# Altium project iMX6_Pixhawk.PrjPcb (part 3 of 6)

## Sheet [09] - USB.SchDoc
size A2; DocumentNumber: 9; SheetNumber: 9; SheetTotal: 18
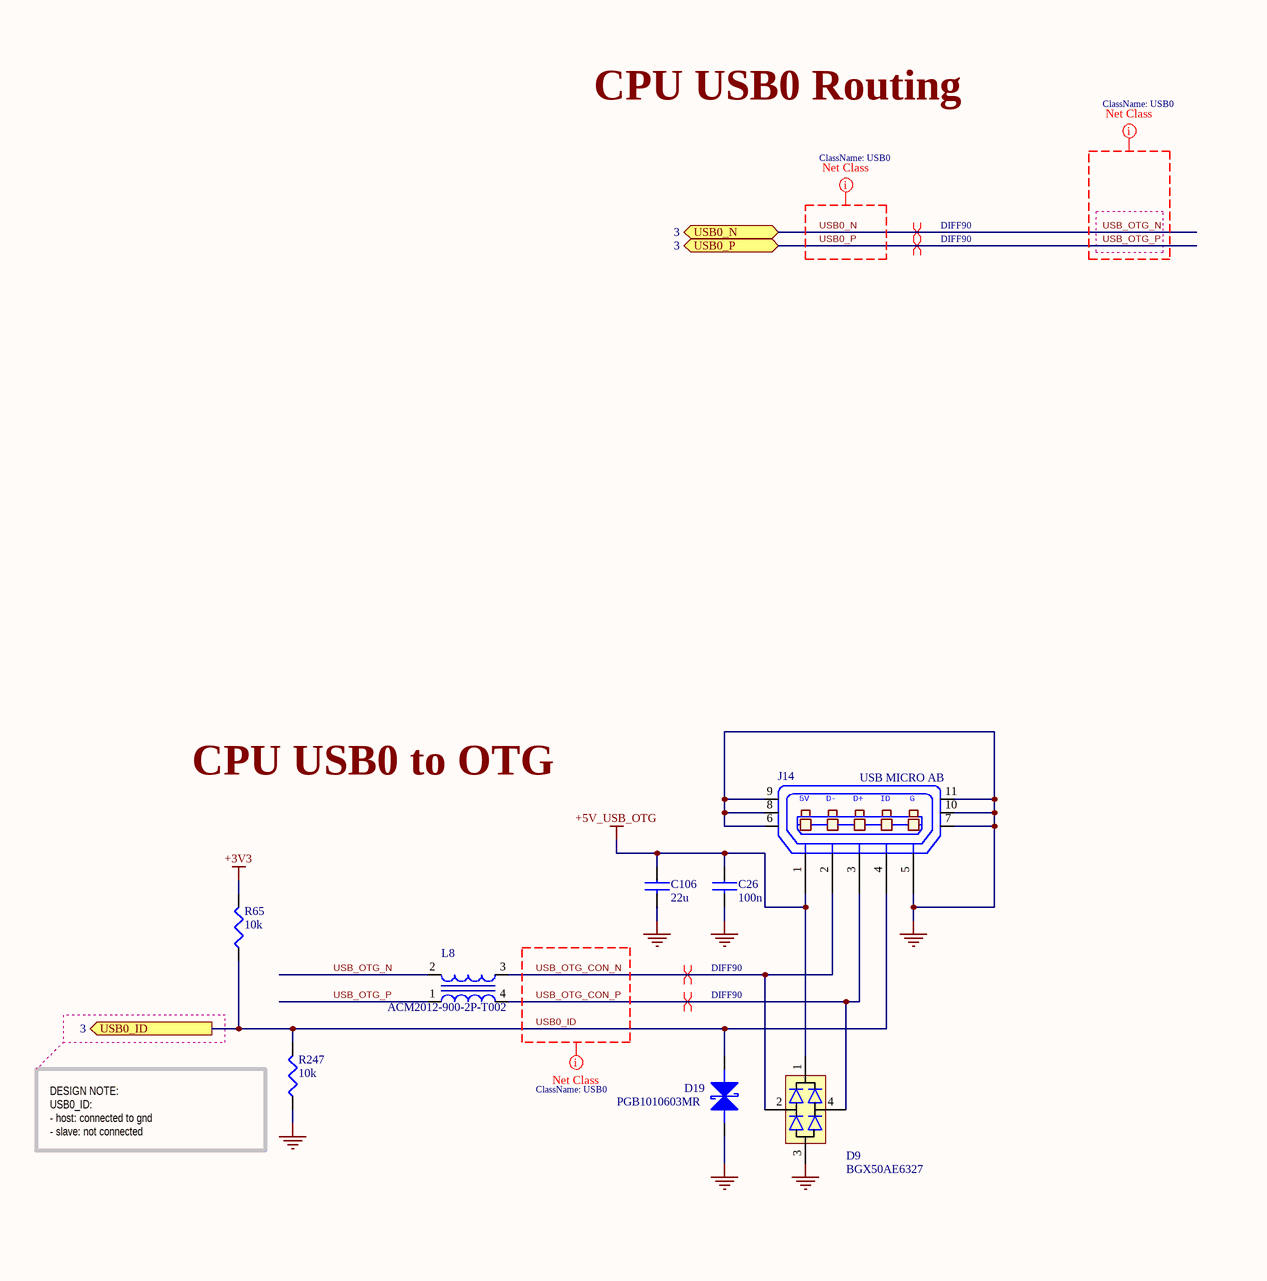
[diagram p10: [09] - USB.SchDoc, left]
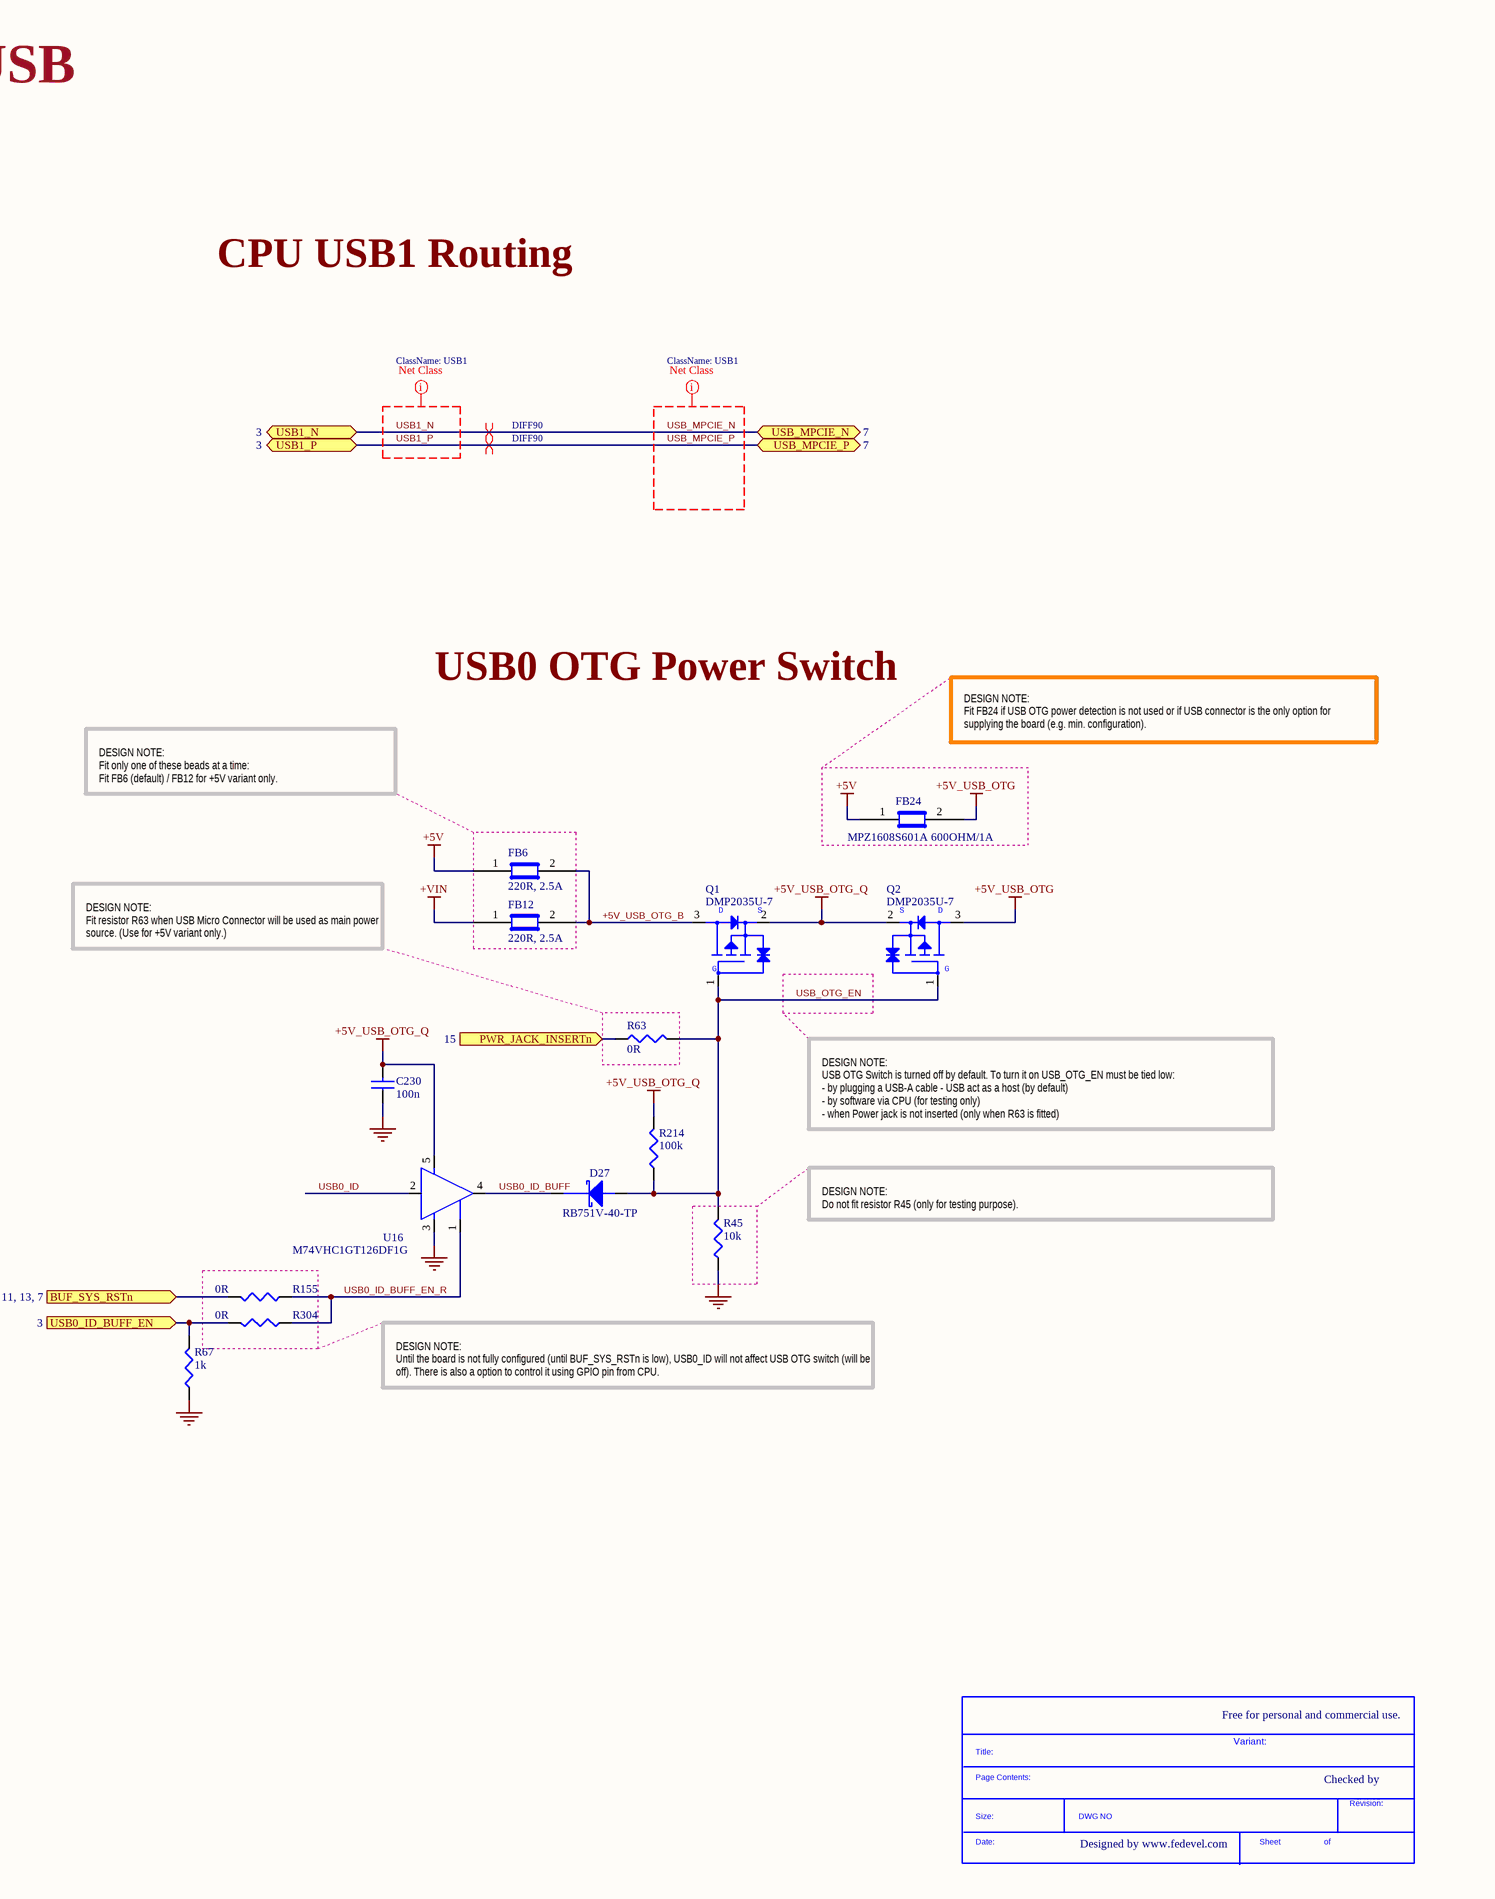
[diagram p11: [09] - USB.SchDoc, right]

### Parts
(Parts that share a designator on the sheet are numbered #1, #2 ... from top to bottom, then left to right.)
*#7  SDTitleBlock  (value not drawn)  (graphical)
C26  100n  [C0402]
C106  22u  [C0805]
C230  100n  [C0402]
D9  BGX50AE6327  [SOT143]
D19  PGB1010603MR  [C0603]
D27  RB751V-40-TP  [SOD323]
FB6  220R, 2.5A  [C0603]
FB12  220R, 2.5A  [C0603]
FB24  MPZ1608S601A 600OHM/1A  [C0603]
J14  USB MICRO AB  [USB_Micro_AB]
L8  ACM2012-900-2P-T002  [ACM2012]
Q1  DMP2035U-7  [SOT-23-3-123]
Q2  DMP2035U-7  [SOT-23-3-123]
R45  10k  [R0402]
R63  0R  [R0402]
R65  10k  [R0402]
R67  1k  [R0402]
R155  0R  [R0402]
R214  100k  [R0402]
R247  10k  [R0402]
R304  0R  [R0402]
U16  M74VHC1GT126DF1G  [SC70_5]

### Ports
BUF_SYS_RSTn (see 11, 13, 7), PWR_JACK_INSERTn (in, see 15), USB0_ID (out, see 3), USB0_ID_BUFF_EN (in, see 3), USB0_N (bidir, see 3), USB0_P (bidir, see 3), USB1_N (bidir, see 3), USB1_P (bidir, see 3), USB_MPCIE_N (bidir, see 7), USB_MPCIE_P (bidir, see 7)

### Nets
+3V3: R65.2
+5V: FB6.1 FB24.1
+5V_USB_OTG: C26.1 C106.1 D9.1 FB24.2 J14.1(P1) Q2.3
+5V_USB_OTG_Q: C230.2 Q1.2 Q2.2 R214.2 U16.5(VCC)
+VIN: FB12.1
GND: C26.2 C106.2 C230.1 D9.3 D19.2 J14.5(P5) J14.6 J14.7 J14.8 J14.9 J14.10 J14.11 R45.1 R67.1 R247.1 U16.3(GND)
+5V_USB_OTG_B: FB6.2 FB12.2 Q1.3
USB0_ID: D19.1 J14.4(P4) R65.1 R247.2 U16.2(I) ; port USB0_ID
USB0_ID_BUFF: D27.1(cathode) U16.4(O)
USB0_ID_BUFF_EN_R: R155.1 R304.1 U16.1(OE#)
USB0_N: L8.2 ; port USB0_N  [also labelled USB_OTG_N]
USB0_P: L8.1 ; port USB0_P  [also labelled USB_OTG_P]
USB1_N: port USB1_N, port USB_MPCIE_N  [also labelled USB_MPCIE_N]
USB1_P: port USB1_P, port USB_MPCIE_P  [also labelled USB_MPCIE_P]
USB_OTG_CON_N: D9.2 J14.2(P2) L8.3
USB_OTG_CON_P: D9.4 J14.3(P3) L8.4
USB_OTG_EN: D27.2(ANODE) Q1.1 Q2.1 R45.2 R63.2 R214.1
NetJ1_38: R67.2 R304.2 ; port USB0_ID_BUFF_EN
NetJ13_22: R155.2 ; port BUF_SYS_RSTn
NetR63_1: R63.1 ; port PWR_JACK_INSERTn

### Layout directives
differential pair; net class DIFF90: USB0_N, USB0_P, USB1_N, USB1_P, USB_OTG_CON_N, USB_OTG_CON_P
net class USB0: USB0_ID, USB0_N, USB0_P, USB_OTG_CON_N, USB_OTG_CON_P, USB_OTG_N, USB_OTG_P
net class USB1: USB1_N, USB1_P, USB_MPCIE_N, USB_MPCIE_P

### Notes on the sheet
- USB
- CPU USB0 Routing
- CPU USB1 Routing
- USB0 OTG Power Switch
- DESIGN NOTE:
  Fit FB24 if USB OTG power detection is not used or if USB connector is the only option for supplying the board (e.g. min. configuration).
- DESIGN NOTE:
  Fit only one of these beads at a time:
  Fit FB6 (default) / FB12 for +5V variant only.
- CPU USB0 to OTG
- DESIGN NOTE:
  Fit resistor R63 when USB Micro Connector will be used as main power source. (Use for +5V variant only.)
- DESIGN NOTE:
  USB OTG Switch is turned off by default. To turn it on USB_OTG_EN must be tied low:
  - by plugging a USB-A cable - USB act as a host (by default)
  - by software via CPU (for testing only)
  - when Power jack is not inserted (only when R63 is fitted)
- DESIGN NOTE:
  Do not fit resistor R45 (only for testing purpose).
- (near R247) DESIGN NOTE:
  USB0_ID:
  - host: connected to gnd
  - slave: not connected
- DESIGN NOTE:
  Until the board is not fully configured (until BUF_SYS_RSTn is low), USB0_ID will not affect USB OTG switch (will be off). There is also a option to control it using GPIO pin from CPU.
- Free for personal and commercial use.
- Variant:
- Checked by
- Designed by www.fedevel.com
- (in symbol 0475890001) 5V; D-; D+; ID; G
- (in symbol DMP2035U-7) D; S; G
- (in symbol SDTitleBlock) Title:; Page Contents:; Revision:; Size:; DWG NO; Date:; Sheet; of

### Library data of the parts
C26 C230 = C1005X5R1H104K: CAP CER .10UF 50V X5R 10% 0402; Manufacturer: TDK Corporation; Capacitance: 0.1µF; Value: 100nF; .Checked PCB: used; Category: Capacitors; Supplier Part Number: 445-5942-1-ND; Manufacturer Part Number: C1005X5R1H104K; Operating Temperature: -55°C ~ 85°C; Package / Case: 0402 (1005 Metric); Price 1k [$]: 0.02340; .Checked SCH: used; Voltage - Rated: 50V; Supplier: Digikey; Supplier 1: Digi-Key; Supplier Part Number 1: 445-5942-1-ND; RoHS: RoHS Compliant; Stock 1: 106926; Pricing 1: 1=0.27, 10=0.18, 100=0.072, 250=0.05176, 500=0.0369, 1000=0.027 (USD); Tolerance: ±10%; Temperature Coefficient: X5R; Mounting Type: Surface Mount, MLCC; Applications: General Purpose; Ratings: -; Size / Dimension: 0.039" L x 0.020" W (1.00mm x 0.50mm); Height - Seated (Max): -; Thickness (Max): 0.022" (0.55mm); Lead Spacing: -; Features: -; Packaging: Cut Tape (CT); Lead Style: -; ComponentLink1URL: http://www.tdk.co.jp/tefe02/e412_c.pdf; ComponentLink1Description: http://www.tdk.co.jp/tefe02/e412_c.pdf
C106 = C2012X5R1C226K: CAP CER 22UF 16V 10% X5R 0805; Manufacturer: TDK Corporation; Capacitance: 22µF; .Checked PCB: RF; Supplier 1: Digi-Key; Supplier Part Number 1: 445-6797-1-ND; Manufacturer Part Number: C2012X5R1C226K; RoHS: RoHS Compliant; Category: Capacitors; Stock 1: 15408; Pricing 1: 1=0.77, 10=0.737, 100=0.3575, 250=0.297, 500=0.2695, 1000=0.2475 (USD); Voltage - Rated: 16V; Tolerance: ±10%; Temperature Coefficient: X5R; Mounting Type: Surface Mount, MLCC; Operating Temperature: -55°C ~ 85°C; Applications: General Purpose; Ratings: -; Package / Case: 0805 (2012 Metric); Size / Dimension: 0.079" L x 0.049" W (2.00mm x 1.25mm); Height - Seated (Max): -; Thickness (Max): 0.057" (1.45mm); Lead Spacing: -; Features: -; Packaging: Cut Tape (CT); Lead Style: -; ComponentLink1URL: http://www.tdk.com/pdf/general_B11.pdf; ComponentLink1Description: http://www.tdk.com/pdf/general_B11.pdf; .Checked SCH: RF
D9 = BGX50AE6327: DIODE SWITCHING 50V SOT-143; Manufacturer: Infineon Technologies; .Checked PCB: used; Current - DC Forward (If): 140mA; Diode Type: Single Phase; Speed: Small Signal =< 200mA (Io), Any Speed; Reverse Recovery Time (trr): 6ns; .Checked SCH: used; Category: Discrete Semiconductor Products; Family: Bridge Rectifiers; Manufacturer Part Number: BGX50AE6327; Package / Case: TO-253-4, TO-253AA; Price 1k [$]: 0.10013; Supplier: Digikey; Supplier Part Number: BGX50AINCT-ND; Value: BGX50AE6327; Supplier 1: Digi-Key; Supplier Part Number 1: BGX50AINCT-ND; RoHS: RoHS Compliant; Stock 1: 438; Pricing 1: 1=0.47, 10=0.334, 100=0.2225, 500=0.12906, 1000=0.10013 (USD); Voltage - Peak Reverse (Max): 50V; Mounting Type: Surface Mount; Packaging: Cut Tape (CT); Supplier Device Package: PG-SOT143-4; ComponentLink1URL: http://www.infineon.com/dgdl/bgx50aseries.pdf?folderId=db3a30431400ef6801141cc1c4cd04e8&fileId=db3a30431400ef6801141cc423c404e9; ComponentLink1Description: http://www.infineon.com/dgdl/bgx50aseries.pdf?folderId=db3a30431400ef6801141cc1c4cd04e8&fileId=db3a30431400ef6801141cc423c404e9
D19 = PGB1010603MR: SUPPRESSOR ESD 24VDC 0603 SMD; Manufacturer: Littelfuse Inc; Voltage - Reverse Standoff (Typ): 24V; Polarization: Bidirectional; .Creator: MM; .Checked PCB: used; Supplier 1: Digi-Key; Manufacturer Part Number: PGB1010603MR; RoHS: RoHS Compliant; Category: Circuit Protection; Stock 1: 155406; Pricing 1: 1=0.66, 10=0.556, 25=0.4872, 100=0.4172, 250=0.3618, 500=0.30646 (USD); Packaging: Cut Tape (CT); Voltage - Breakdown: -; Power (Watts): -; Mounting Type: Surface Mount; Package / Case: 0603 (1608 Metric); Supplier Device Package: 0603 (1608 Metric); ComponentLink1URL: http://www.littelfuse.com/data/en/Data_Sheets/Littelfuse_PulseGuard-ESD_PGB1.pdf; ComponentLink1Description: http://www.littelfuse.com/data/en/Data_Sheets/Littelfuse_PulseGuard-ESD_PGB1.pdf; Supplier Part Number 1: F2594CT-ND; .Checked SCH: used
D27 = RB751V-40-TP: DIODE SCHTKY 30MA 30V SOD-323; Manufacturer: Micro Commercial Co; Diode Type: Schottky; Voltage - Forward (Vf) (Max) @ If: 370mV @ 1mA; Speed: Small Signal =< 200mA (Io), Any Speed; Current - Reverse Leakage @ Vr: 500nA @ 30V; Capacitance @ Vr, F: 2pF @ 1V, 1MHz; .Checked PCB: used; Supplier 1: Digi-Key; Supplier Part Number 1: RB751V-40-TPMSCT-ND; Manufacturer Part Number: RB751V-40-TP; RoHS: RoHS Compliant; Category: Discrete Semiconductor Products; Stock 1: 18964; Pricing 1: 1=0.48, 10=0.342, 100=0.2014, 250=0.14252, 500=0.1216, 1000=0.095 (USD); Voltage - DC Reverse (Vr) (Max): 30V; Current - Average Rectified (Io): 30mA; Reverse Recovery Time (trr): -; Mounting Type: Surface Mount; Package / Case: SC-76, SOD-323; Supplier Device Package: SOD-323; Packaging: Cut Tape (CT); ComponentLink1URL: http://61.222.192.61/mccsemi/up_pdf/RB751V-40(SOD-323).PDF; ComponentLink1Description: http://61.222.192.61/mccsemi/up_pdf/RB751V-40(SOD-323).PDF; .Checked SCH: used
FB6 FB12 = BLM18SG221TN1D: FERRITE CHIP 220 OHM 2500MA 0603; Manufacturer: Murata Electronics North America; Impedance @ Frequency: 220 Ohm @ 100MHz; DC Resistance (DCR): 40 mOhm Max; Filter Type: Differential Mode - Single; Number of Lines: 1; .Checked PCB: used; Supplier 1: Digi-Key; Supplier Part Number 1: 490-5225-1-ND; Manufacturer Part Number: BLM18SG221TN1D; RoHS: RoHS Compliant; Category: Filters; Stock 1: 54640; Pricing 1: 1=0.38, 10=0.282, 50=0.1646, 100=0.1316, 250=0.094, 500=0.06392, 1000=0.0517, 5000=0.04042 (USD); Current Rating: 2.5A; Package / Case: 0603 (1608 Metric); Mounting Type: Surface Mount; Packaging: Cut Tape (CT); Height (Max): 0.037" (0.95mm); Size / Dimension: 0.063" L x 0.031" W (1.60mm x 0.80mm); ComponentLink1URL: http://search.murata.co.jp/Ceramy/image/img/PDF/ENG/L0110S0100BLM18S.pdf; ComponentLink1Description: http://search.murata.co.jp/Ceramy/image/img/PDF/ENG/L0110S0100BLM18S.pdf; .Checked SCH: used
FB24 = MPZ1608S601A: FERRITE CHIP BEAD 600 OHM SMD 1A; Manufacturer: TDK Corporation; Impedance @ Frequency: 600 Ohm @ 100MHz; DC Resistance (DCR): 150 mOhm Max; Filter Type: Differential Mode - Single; Number of Lines: 1; .Checked PCB: used; Supplier 1: Digi-Key; Supplier Part Number 1: 445-2205-1-ND; Manufacturer Part Number: MPZ1608S601A; RoHS: RoHS Compliant; Category: Filters; Stock 1: 328345; Pricing 1: 1=0.36, 10=0.24, 100=0.096, 250=0.069, 500=0.0492, 1000=0.036 (USD); Current Rating: 1A; Package / Case: 0603 (1608 Metric); Mounting Type: Surface Mount; Packaging: Cut Tape (CT); Height (Max): 0.037" (0.95mm); Size / Dimension: 0.063" L x 0.031" W (1.60mm x 0.80mm); ComponentLink1URL: http://www.tdk.co.jp/tefe02/e9413_mpz.pdf; ComponentLink1Description: http://www.tdk.co.jp/tefe02/e9413_mpz.pdf; .Checked SCH: used
J14 = 0475890001: CONN RCPT MICRO USB AB R/A SMD; Manufacturer: Molex Inc; Connector Type: USB - micro AB; Number of Contacts: 5; Gender: Receptacle; .Creator: MM; .Checked PCB: used; Supplier 1: Digi-Key; Manufacturer Part Number: 0475890001; RoHS: RoHS Compliant; Category: Connectors, Interconnects; Stock 1: 12754; Pricing 1: 1=0.81, 10=0.764, 25=0.6872, 50=0.6108, 100=0.5854, 250=0.53452, 500=0.50908 (USD); Packaging: Cut Tape (CT); Specifications: -; Mounting Type: Surface Mount, Right Angle, Horizontal; Features: Board Guide, Shielded; Ingress Protection: -; ComponentLink1URL: http://www.molex.com/pdm_docs/sd/475890001_sd.pdf; ComponentLink1Description: http://www.molex.com/pdm_docs/sd/475890001_sd.pdf; Supplier Part Number 1: WM17143CT-ND; .Checked SCH: used
L8 = ACM2012-900-2P-T002: CHOKE COMM MODE 90 OHM .4A SMD; Manufacturer: TDK Corporation; Filter Type: Data, Signal Line; Number of Lines: 2; Current: 400mA; DC Resistance (DCR): 190 mOhm Max; Impedance: 90 Ohm; Resistance (Ohms): 8.2K; Power (Watts): 0.063W, 1/16W; Temperature Coefficient: ±100ppm/°C; Tolerance: ±1%; .Checked PCB: used; Supplier 1: Digi-Key; Supplier Part Number 1: 445-2207-1-ND; Manufacturer Part Number: ACM2012-900-2P-T002; RoHS: RoHS Compliant; Category: Filters; Stock 1: 175768; Pricing 1: 1=0.48, 10=0.448, 50=0.42, 100=0.364, 500=0.308, 1000=0.252 (USD); Inductance: -; Mounting Type: Surface Mount; Size / Dimension: 0.079" L x 0.047" W (2.00mm x 1.20mm); Height (Max): 0.051" (1.30mm); Package / Case: 0805 (2012 Metric), 4 Lead; Operating Temperature: -25°C ~ 85°C; Packaging: Cut Tape (CT); ComponentLink1URL: http://www.tdk.co.jp/tefe02/e9719_acm2012.pdf; ComponentLink1Description: http://www.tdk.co.jp/tefe02/e9719_acm2012.pdf; Composition: Thick Film; Features: -; Height: 0.016" (0.40mm); Number of Terminations: 2; ComponentLink2URL: http://www.yageo.com/documents/recent/PYu-RC0402_51_RoHS_L_6.pdf; ComponentLink2Description: http://www.yageo.com/documents/recent/PYu-RC0402_51_RoHS_L_6.pdf; .Checked SCH: used
Q1 Q2 = DMP2035U-7: MOSFET P-CH 20V 3.6A SOT-23; Manufacturer: Diodes Incorporated; FET Type: MOSFET P-Channel, Metal Oxide; FET Feature: Logic Level Gate; Current - Continuous Drain (Id) @ 25°C: 3.6A (Ta); Rds On (Max) @ Id, Vgs: 35 mOhm @ 4A, 4.5V; Vgs(th) (Max) @ Id: 1V @ 250µA; Gate Charge (Qg) @ Vgs: 15.4nC @ 4.5V; Input Capacitance (Ciss) @ Vds: 1610pF @ 10V; Power - Max: 810mW; .Checked PCB: MM; Supplier 1: Digi-Key; Manufacturer Part Number: DMP2035U-7; RoHS: RoHS Compliant; Category: Discrete Semiconductor Products; Stock 1: 71721; Pricing 1: 1=0.49, 10=0.345, 25=0.2836, 100=0.2265, 250=0.165, 500=0.134, 1000=0.103 (USD); Packaging: Cut Tape (CT); Drain to Source Voltage (Vdss): 20V; Mounting Type: Surface Mount; Package / Case: TO-236-3, SC-59, SOT-23-3; Supplier Device Package: SOT-23-3; ComponentLink1URL: http://www.diodes.com/datasheets/ds31830.pdf; ComponentLink1Description: http://www.diodes.com/datasheets/ds31830.pdf; Supplier Part Number 1: DMP2035U-7DICT-ND; .Checked SCH: MM; .Creator: MM
R45 R65 R247 = RC0402FR-0710KL: RES 10.0K OHM 1/16W 1% 0402 SMD; Manufacturer: Yageo; Power (Watts): 0.063W, 1/16W; .Checked PCB: used; Temperature Coefficient: ±100ppm/°C; Category: Resistors; Supplier Part Number: 311-10.0KLRCT-ND; Manufacturer Part Number: RC0402FR-0710KL; Package / Case: 0402 (1005 Metric); Price 1k [$]: 0.01421; Resistance (Ohms): 10K; Tolerance: ±1%; Value: 10k; .Checked SCH: used; Supplier: Digikey; Supplier 1: Digi-Key; Supplier Part Number 1: 311-10.0KLRCT-ND; RoHS: RoHS Compliant; Stock 1: 2916495; Pricing 1: 10=0.014, 50=0.0104, 100=0.0079, 250=0.00584, 500=0.00432, 1000=0.00288 (USD); Composition: Thick Film; Features: -; Size / Dimension: 0.039" L x 0.020" W (1.00mm x 0.50mm); Height: 0.016" (0.40mm); Number of Terminations: 2; Packaging: Cut Tape (CT); ComponentLink1URL: http://www.yageo.com/documents/recent/PYu-RC0402_51_RoHS_L_6.pdf; ComponentLink1Description: http://www.yageo.com/documents/recent/PYu-RC0402_51_RoHS_L_6.pdf
R63 R155 R304 = RC0402JR-070RL: RES 0.0 OHM 1/16W 0402 SMD; Manufacturer: Yageo; Resistance (Ohms): 0.0; Power (Watts): 0.063W, 1/16W; Tolerance: Jumper; .Checked PCB: used; Category: Resistors; Supplier Part Number: 311-0.0JRCT-ND; Manufacturer Part Number: RC0402JR-070RL; Package / Case: 0402 (1005 Metric); Price 1k [$]: 0.01389; Value: 0R; .Checked SCH: used; Supplier: Digikey; Supplier 1: Digi-Key; Supplier Part Number 1: 311-0.0JRCT-ND; RoHS: RoHS Compliant; Stock 1: 1106330; Pricing 1: 10=0.012, 50=0.009, 100=0.0069, 250=0.00512, 500=0.0038, 1000=0.00253 (USD); Composition: Thick Film; Features: -; Temperature Coefficient: -; Size / Dimension: 0.039" L x 0.020" W (1.00mm x 0.50mm); Height: 0.016" (0.40mm); Number of Terminations: 2; Packaging: Cut Tape (CT); ComponentLink1URL: http://www.yageo.com/documents/recent/PYu-RC0402_51_RoHS_L_6.pdf; ComponentLink1Description: http://www.yageo.com/documents/recent/PYu-RC0402_51_RoHS_L_6.pdf
R67 = RC0402FR-071KL: RES 1.00K OHM 1/16W 1% 0402 SMD; Manufacturer: Yageo; Power (Watts): 0.063W, 1/16W; .Checked PCB: used; Temperature Coefficient: ±100ppm/°C; Category: Resistors; Supplier Part Number: 311-1.00KLRCT-ND; Manufacturer Part Number: RC0402FR-071KL; Package / Case: 0402 (1005 Metric); Price 1k [$]: 0.01421; Resistance (Ohms): 1K; Tolerance: ±1%; Value: 1k; .Checked SCH: used; Supplier: Digikey; Supplier 1: Digi-Key; Supplier Part Number 1: 311-1.00KLRCT-ND; RoHS: RoHS Compliant; Stock 1: 1753477; Pricing 1: 10=0.014, 50=0.0104, 100=0.0079, 250=0.00584, 500=0.00432, 1000=0.00288 (USD); Composition: Thick Film; Features: -; Size / Dimension: 0.039" L x 0.020" W (1.00mm x 0.50mm); Height: 0.016" (0.40mm); Number of Terminations: 2; Packaging: Cut Tape (CT); ComponentLink1URL: http://www.yageo.com/documents/recent/PYu-RC0402_51_RoHS_L_6.pdf; ComponentLink1Description: http://www.yageo.com/documents/recent/PYu-RC0402_51_RoHS_L_6.pdf
R214 = RMCF0402FT100K: RES 100K OHM 1/16W 1% 0402 SMD; Manufacturer: Stackpole Electronics Inc; Power (Watts): 0.063W, 1/16W; .Checked PCB: used; Temperature Coefficient: ±100ppm/°C; Category: Resistors; Supplier Part Number: RMCF0402FT100KCT-ND; Manufacturer Part Number: RMCF0402FT100K; Package / Case: 0402 (1005 Metric); Price 1k [$]: 0.00384; Resistance (Ohms): 100K; Tolerance: ±1%; Value: 100k; .Checked SCH: used; Supplier: Digikey; Supplier 1: Digi-Key; Supplier Part Number 1: RMCF0402FT100KCT-ND; RoHS: RoHS Compliant; Stock 1: 95; Pricing 1: 1=0.04, 10=0.025, 50=0.0138, 100=0.0105, 250=0.0078, 500=0.00576, 1000=0.00384 (USD); Composition: Thick Film; Features: -; Size / Dimension: 0.039" L x 0.020" W (1.00mm x 0.50mm); Height: 0.016" (0.40mm); Number of Terminations: 2; Packaging: Cut Tape (CT); ComponentLink1URL: http://www.seielect.com/Catalog/SEI-RMCF.pdf; ComponentLink1Description: http://www.seielect.com/Catalog/SEI-RMCF.pdf
U16 = M74VHC1GT126DF1G: IC BUFF CMOS LVL/SFTR N-I SOT353; Manufacturer: ON Semiconductor; Logic Type: Buffer/Line Driver, Non-Inverting; Number of Elements: 1; Current - Output High, Low: 8mA, 8mA; Voltage - Supply: 3 V ~ 5.5 V; .Checked PCB: MM; Supplier 1: Digi-Key; Manufacturer Part Number: M74VHC1GT126DF1G; RoHS: RoHS Compliant; Category: Integrated Circuits (ICs); Stock 1: 6821; Pricing 1: 1=0.36, 10=0.326, 25=0.2344, 100=0.1824, 250=0.1146, 500=0.09766, 1000=0.06654 (USD); Packaging: Cut Tape (CT); Number of Bits per Element: 1; Operating Temperature: -55°C ~ 125°C; Mounting Type: Surface Mount; Package / Case: 5-TSSOP, SC-70-5, SOT-353; Supplier Device Package: SC-70; ComponentLink1URL: http://www.onsemi.com/pub_link/Collateral/MC74VHC1GT126-D.PDF; ComponentLink1Description: http://www.onsemi.com/pub_link/Collateral/MC74VHC1GT126-D.PDF; Supplier Part Number 1: M74VHC1GT126DF1GOSCT-ND; .Checked SCH: MM; .Creator: MM

## Sheet [11] - SD CARD, BUFFERS.SchDoc
size A3; DocumentNumber: 11; SheetNumber: 11; SheetTotal: 18
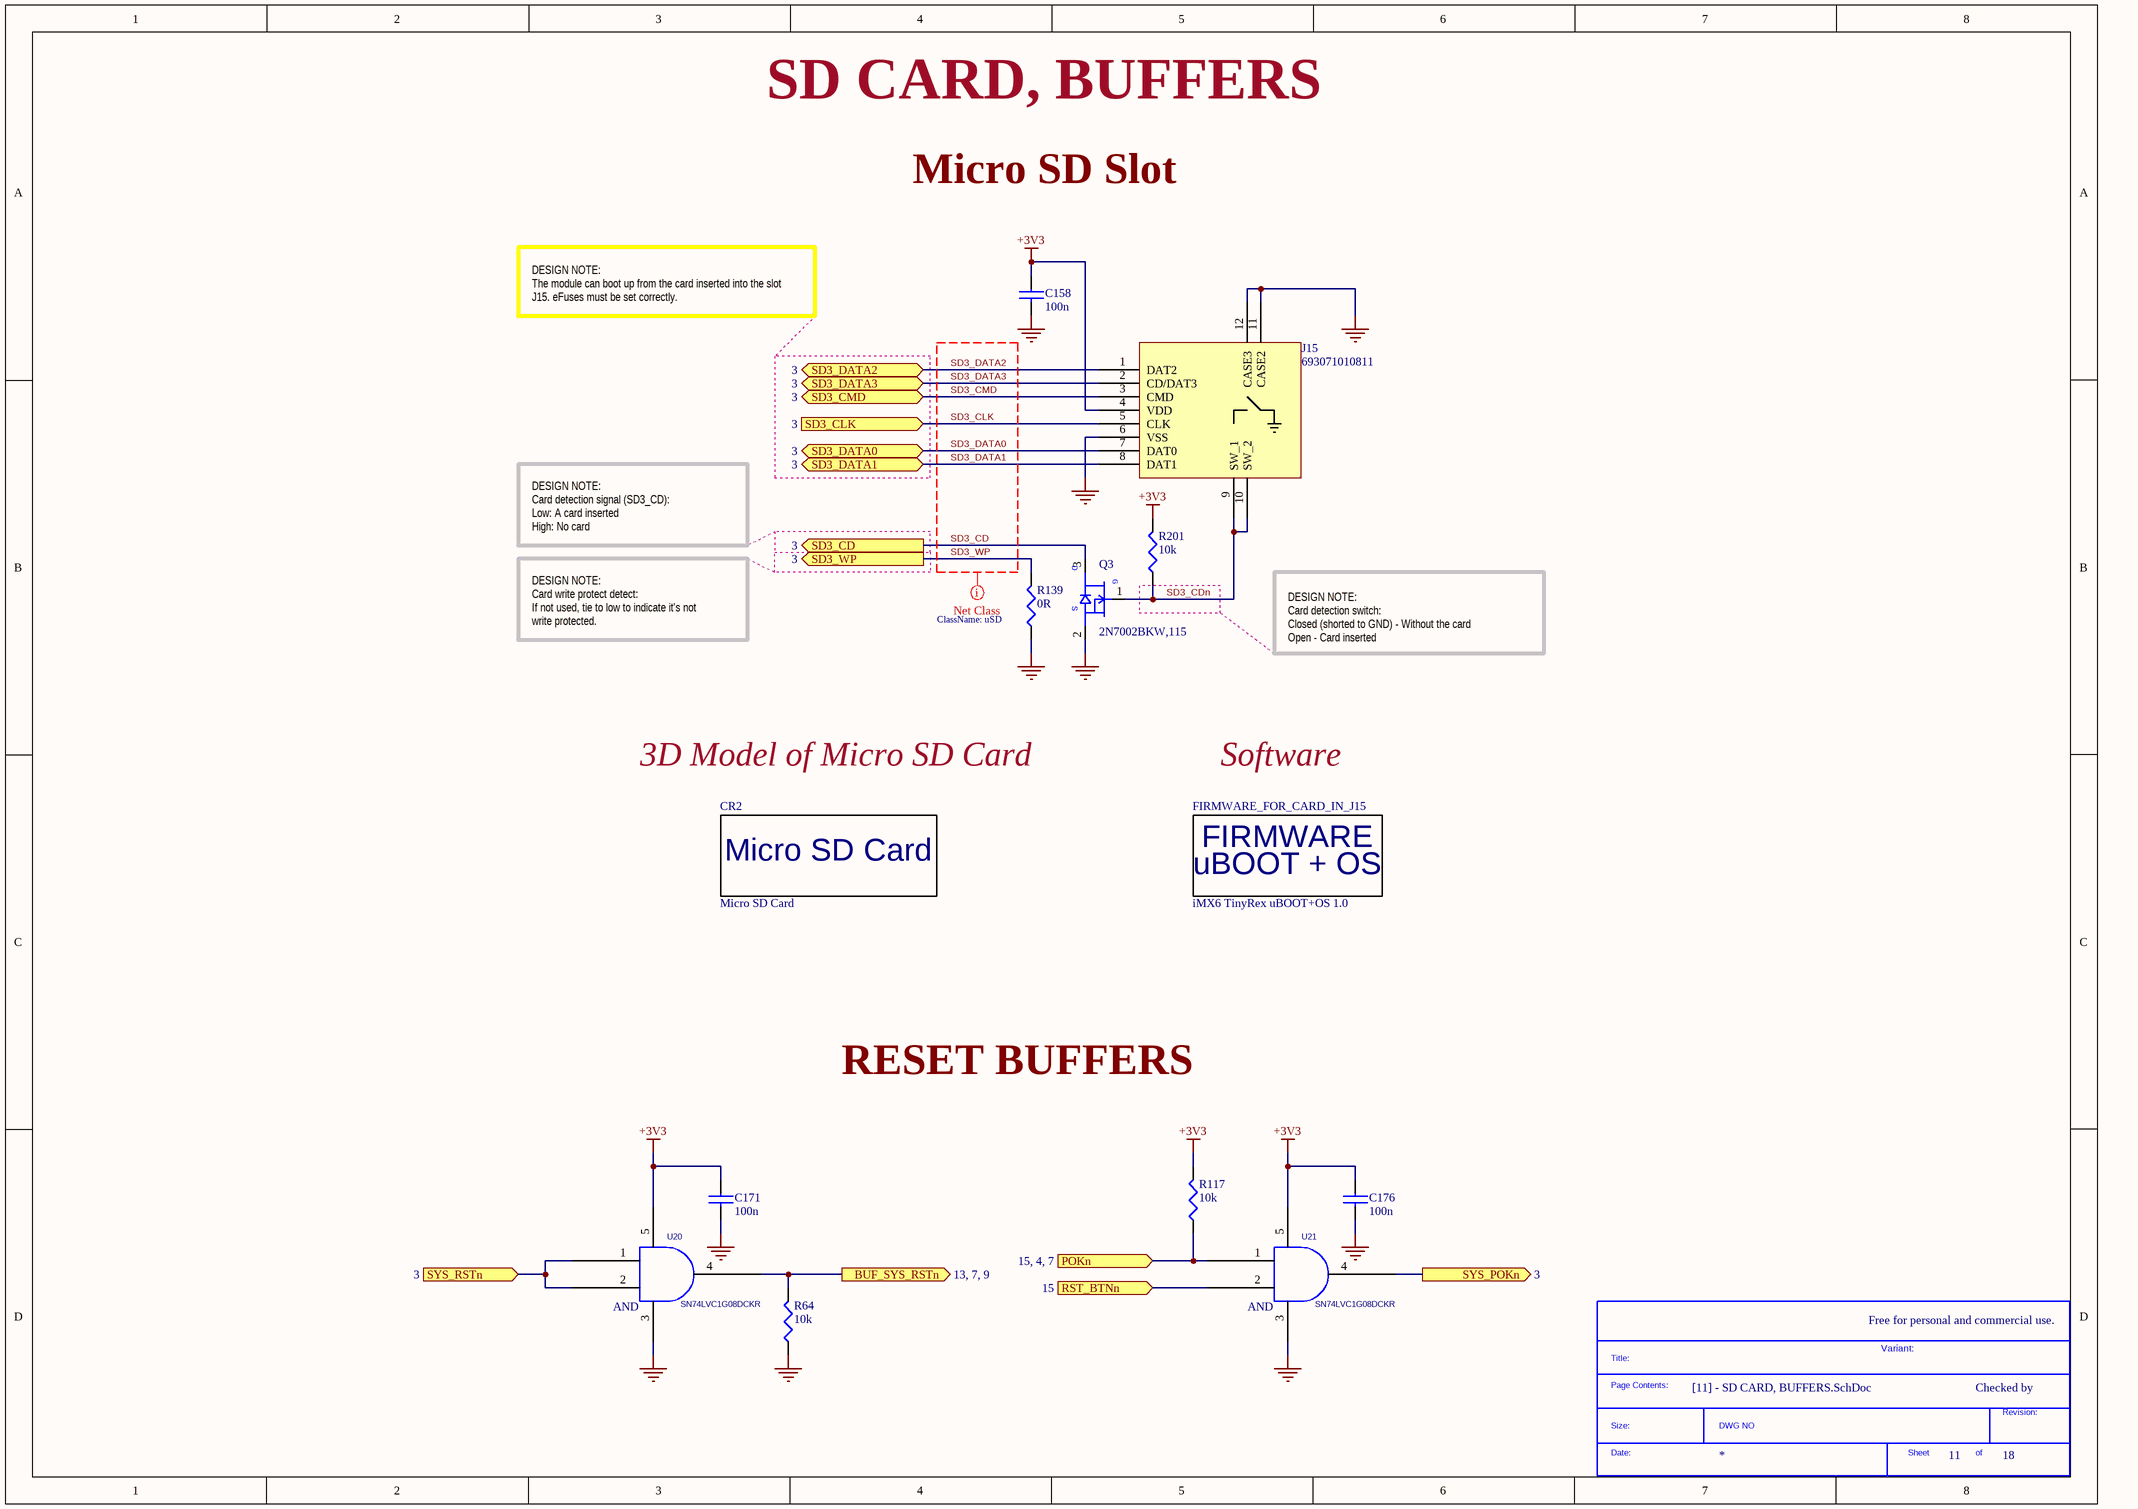
[diagram p12: [11] - SD CARD, BUFFERS.SchDoc]

### Parts
(Parts that share a designator on the sheet are numbered #1, #2 ... from top to bottom, then left to right.)
*#8  SDTitleBlock  (value not drawn)  (graphical)
C158  100n  [C0402]
C171  100n  [C0402]
C176  100n  [C0402]
CR2  Micro SD Card  [Micro_SD_card]  (no BOM)
FIRMWARE_FOR_CARD_IN_J15  iMX6 TinyRex uBOOT+OS 1.0  (mechanical)
J15  693071010811  [693071010811]
Q3  2N7002BKW,115  [SC70_SOT323]
R64  10k  [R0402]
R117  10k  [R0402]
R139  0R  [R0402]
R201  10k  [R0402]
U20  SN74LVC1G08DCKR  [SC70_5]
U21  SN74LVC1G08DCKR  [SC70_5]

### Ports
BUF_SYS_RSTn (see 13, 7, 9), POKn (see 15, 4, 7), RST_BTNn (in, see 15), SD3_CD (out, see 3), SD3_CLK (in, see 3), SD3_CMD (bidir, see 3), SD3_DATA0 (bidir, see 3), SD3_DATA1 (bidir, see 3), SD3_DATA2 (bidir, see 3), SD3_DATA3 (bidir, see 3), SD3_WP (out, see 3), SYS_POKn (out, see 3), SYS_RSTn (in, see 3)

### Nets
+3V3: C158.1 C171.1 C176.1 J15.4(VDD) R117.2 R201.2 U20.5(VCC) U21.5(VCC)
GND: C158.2 C171.2 C176.2 J15.6(VSS) J15.11(CASE2) J15.12(CASE3) Q3.2(SOURCE) R64.1 R139.1 U20.3(GND) U21.3(GND)
SD3_CD: Q3.3(DRAIN) ; port SD3_CD
SD3_CDn: J15.9(SW_1) J15.10(SW_2) Q3.1(GATE) R201.1
SD3_CLK: J15.5(CLK) ; port SD3_CLK
SD3_CMD: J15.3(CMD) ; port SD3_CMD
SD3_DATA0: J15.7(DAT0) ; port SD3_DATA0
SD3_DATA1: J15.8(DAT1) ; port SD3_DATA1
SD3_DATA2: J15.1(DAT2) ; port SD3_DATA2
SD3_DATA3: J15.2(CD/DAT3) ; port SD3_DATA3
SD3_WP: R139.2 ; port SD3_WP
NetC198_1: U21.2(B) ; port RST_BTNn
NetJ2_2: U21.4(Y) ; port SYS_POKn
NetJ2_4: U20.1(A) U20.2(B) ; port SYS_RSTn
NetJ13_22: R64.2 U20.4(Y) ; port BUF_SYS_RSTn
NetQ4_1: R117.1 U21.1(A) ; port POKn

### Layout directives
net class uSD: SD3_CD, SD3_CLK, SD3_CMD, SD3_DATA0, SD3_DATA1, SD3_DATA2, SD3_DATA3, SD3_WP

### Notes on the sheet
- SD CARD, BUFFERS
- Micro SD Slot
- DESIGN NOTE:
  The module can boot up from the card inserted into the slot J15. eFuses must be set correctly.
- DESIGN NOTE:
  Card detection signal (SD3_CD):
  Low: A card inserted
  High: No card
- DESIGN NOTE:
  Card write protect detect:
  If not used, tie to low to indicate it's not write protected.
- DESIGN NOTE:
  Card detection switch:
  Closed (shorted to GND) - Without the card
  Open - Card inserted
- 3D Model of Micro SD Card
- Software
- RESET BUFFERS
- Free for personal and commercial use.
- Variant:
- Checked by
- (in symbol 2N7002BKW,115) D; G; S
- (in symbol FIRMWARE_iMX6_TinyRex_uBOOT_OS 1.0) FIRMWARE; uBOOT + OS
- (in symbol SDTitleBlock) Title:; Page Contents:; Revision:; Size:; DWG NO; Date:; Sheet; of
- (in symbol SN74LVC1G08DCKR) AND

### Library data of the parts
C158 C171 C176 = C1005X5R1H104K: as C26 on sheet [09] - USB; Category: Capacitors; Supplier Part Number: 445-5942-1-ND; Manufacturer Part Number: C1005X5R1H104K; Operating Temperature: -55°C ~ 85°C; Package / Case: 0402 (1005 Metric); Price 1k [$]: 0.02340; .Checked SCH: used; Voltage - Rated: 50V; Supplier: Digikey; Supplier 1: Digi-Key; Supplier Part Number 1: 445-5942-1-ND; RoHS: RoHS Compliant; Stock 1: 106926; Pricing 1: 1=0.27, 10=0.18, 100=0.072, 250=0.05176, 500=0.0369, 1000=0.027 (USD); Tolerance: ±10%; Temperature Coefficient: X5R; Mounting Type: Surface Mount, MLCC; Applications: General Purpose; Ratings: -; Size / Dimension: 0.039" L x 0.020" W (1.00mm x 0.50mm); Height - Seated (Max): -; Thickness (Max): 0.022" (0.55mm); Lead Spacing: -; Features: -; Packaging: Cut Tape (CT); Lead Style: -; ComponentLink1URL: http://www.tdk.co.jp/tefe02/e412_c.pdf; ComponentLink1Description: http://www.tdk.co.jp/tefe02/e412_c.pdf
CR2 = Card_Micro_SD: Card Micro SD; .Creator: MM; Category: Card
FIRMWARE_FOR_CARD_IN_J15 = FIRMWARE_iMX6_TinyRex_uBOOT_OS 1.0: .Creator: MM; Category: Firmware; .Checked SCH: MM
J15 = 693071010811: CONN MICRO SD 8 POS SMD; Manufacturer: Wurth Electronics Inc; Card Type: Secure Digital - microSD™; Number of Positions: 9 (8 + 1); Connector Type: Connector and Ejector; Insertion, Removal Method: Push In, Push Out; .Creator: MM; .Checked PCB: used; Supplier 1: Digi-Key; Manufacturer Part Number: 693071010811; RoHS: RoHS Compliant; Category: Connectors, Interconnects; Stock 1: 4877; Pricing 1: 1=3.32, 10=3.188, 50=2.805, 100=2.6775, 500=2.295, 1400=2.10375 (USD); Packaging: Cut Tape (CT); Ejector Side: -; Mounting Type: Surface Mount, Right Angle; Features: Switch; Height Above Board: 0.072" (1.83mm); Mounting Feature: Normal, Standard - Top; Contact Finish: Gold; Contact Finish Thickness: -; ComponentLink1URL: http://katalog.we-online.de/em/datasheet/693071010811.pdf; ComponentLink1Description: http://katalog.we-online.de/em/datasheet/693071010811.pdf; Supplier Part Number 1: 732-3819-1-ND; .Checked SCH: used
Q3 = 2N7002BKW,115: MOSFET N-CH 60V 310MA SOT323; Manufacturer: NXP Semiconductors; FET Type: MOSFET N-Channel, Metal Oxide; FET Feature: Logic Level Gate; Rds On (Max) @ Id, Vgs: 1.6 Ohm @ 500mA, 10V; Vgs(th) (Max) @ Id: 2.1V @ 250µA; Gate Charge (Qg) @ Vgs: 0.6nC @ 4.5V; Input Capacitance (Ciss) @ Vds: 50pF @ 10V; Power - Max: 275mW; .Checked PCB: used; Supplier 1: Digi-Key; Supplier Part Number 1: 568-5980-1-ND; Manufacturer Part Number: 2N7002BKW,115; RoHS: RoHS Compliant; Category: Discrete Semiconductor Products; Stock 1: 15666; Pricing 1: 1=0.39, 10=0.354, 25=0.2548, 100=0.1983, 250=0.12456, 500=0.10616, 1000=0.07233 (USD); Drain to Source Voltage (Vdss): 60V; Current - Continuous Drain (Id) @ 25° C: 310mA; Mounting Type: Surface Mount; Package / Case: SC-70, SOT-323; Supplier Device Package: SC-70; Packaging: Cut Tape (CT); ComponentLink1URL: http://www.nxp.com/documents/data_sheet/2N7002BKW.pdf; ComponentLink1Description: http://www.nxp.com/documents/data_sheet/2N7002BKW.pdf; .Checked SCH: used
R64 R117 R201 = RC0402FR-0710KL: as R45 on sheet [09] - USB; Category: Resistors; Supplier Part Number: 311-10.0KLRCT-ND; Manufacturer Part Number: RC0402FR-0710KL; Package / Case: 0402 (1005 Metric); Price 1k [$]: 0.01421; Resistance (Ohms): 10K; Tolerance: ±1%; Value: 10k; .Checked SCH: used; Supplier: Digikey; Supplier 1: Digi-Key; Supplier Part Number 1: 311-10.0KLRCT-ND; RoHS: RoHS Compliant; Stock 1: 2916495; Pricing 1: 10=0.014, 50=0.0104, 100=0.0079, 250=0.00584, 500=0.00432, 1000=0.00288 (USD); Composition: Thick Film; Features: -; Size / Dimension: 0.039" L x 0.020" W (1.00mm x 0.50mm); Height: 0.016" (0.40mm); Number of Terminations: 2; Packaging: Cut Tape (CT); ComponentLink1URL: http://www.yageo.com/documents/recent/PYu-RC0402_51_RoHS_L_6.pdf; ComponentLink1Description: http://www.yageo.com/documents/recent/PYu-RC0402_51_RoHS_L_6.pdf
R139 = RC0402JR-070RL: as R63 on sheet [09] - USB; Category: Resistors; Supplier Part Number: 311-0.0JRCT-ND; Manufacturer Part Number: RC0402JR-070RL; Package / Case: 0402 (1005 Metric); Price 1k [$]: 0.01389; Value: 0R; .Checked SCH: used; Supplier: Digikey; Supplier 1: Digi-Key; Supplier Part Number 1: 311-0.0JRCT-ND; RoHS: RoHS Compliant; Stock 1: 1106330; Pricing 1: 10=0.012, 50=0.009, 100=0.0069, 250=0.00512, 500=0.0038, 1000=0.00253 (USD); Composition: Thick Film; Features: -; Temperature Coefficient: -; Size / Dimension: 0.039" L x 0.020" W (1.00mm x 0.50mm); Height: 0.016" (0.40mm); Number of Terminations: 2; Packaging: Cut Tape (CT); ComponentLink1URL: http://www.yageo.com/documents/recent/PYu-RC0402_51_RoHS_L_6.pdf; ComponentLink1Description: http://www.yageo.com/documents/recent/PYu-RC0402_51_RoHS_L_6.pdf
U20 U21 = SN74LVC1G08DCKR: SINGLE POSITIVE AND GATE SC-70; Manufacturer: Texas Instruments; .Checked PCB: used; Number of Inputs: 2; Voltage - Supply: 1.65 V ~ 5.5 V; Number of Circuits: 1; Current - Output High, Low: 32mA, 32mA; .Checked SCH: used; Category: Integrated Circuits (ICs); Supplier Part Number: 296-11602-1-ND; Family: Logic - Gates and Inverters; Manufacturer Part Number: SN74LVC1G08DCKR; Operating Temperature: -40°C ~ 85°C; Package / Case: 6-TSSOP (5 lead), SC-88A, SOT-353; Price 1k [$]: 0.11250; Value: SN74LVC1G08DCKR; Logic Type: AND Gate; Supplier: Digikey; Supplier 1: Digi-Key; Supplier Part Number 1: 296-11602-1-ND; RoHS: RoHS Compliant; Stock 1: 36212; Pricing 1: 1=0.7, 25=0.322, 100=0.224, 250=0.1596, 500=0.1218, 1000=0.084 (USD); Mounting Type: Surface Mount; Supplier Device Package: SC-70-5; Packaging: Cut Tape (CT); ComponentLink1URL: http://www.ti.com/lit/ds/symlink/sn74lvc1g08.pdf; ComponentLink1Description: http://www.ti.com/lit/ds/symlink/sn74lvc1g08.pdf

## Sheet [12] - UARTS.SchDoc
size A3; DocumentNumber: 12; SheetNumber: 12; SheetTotal: 18
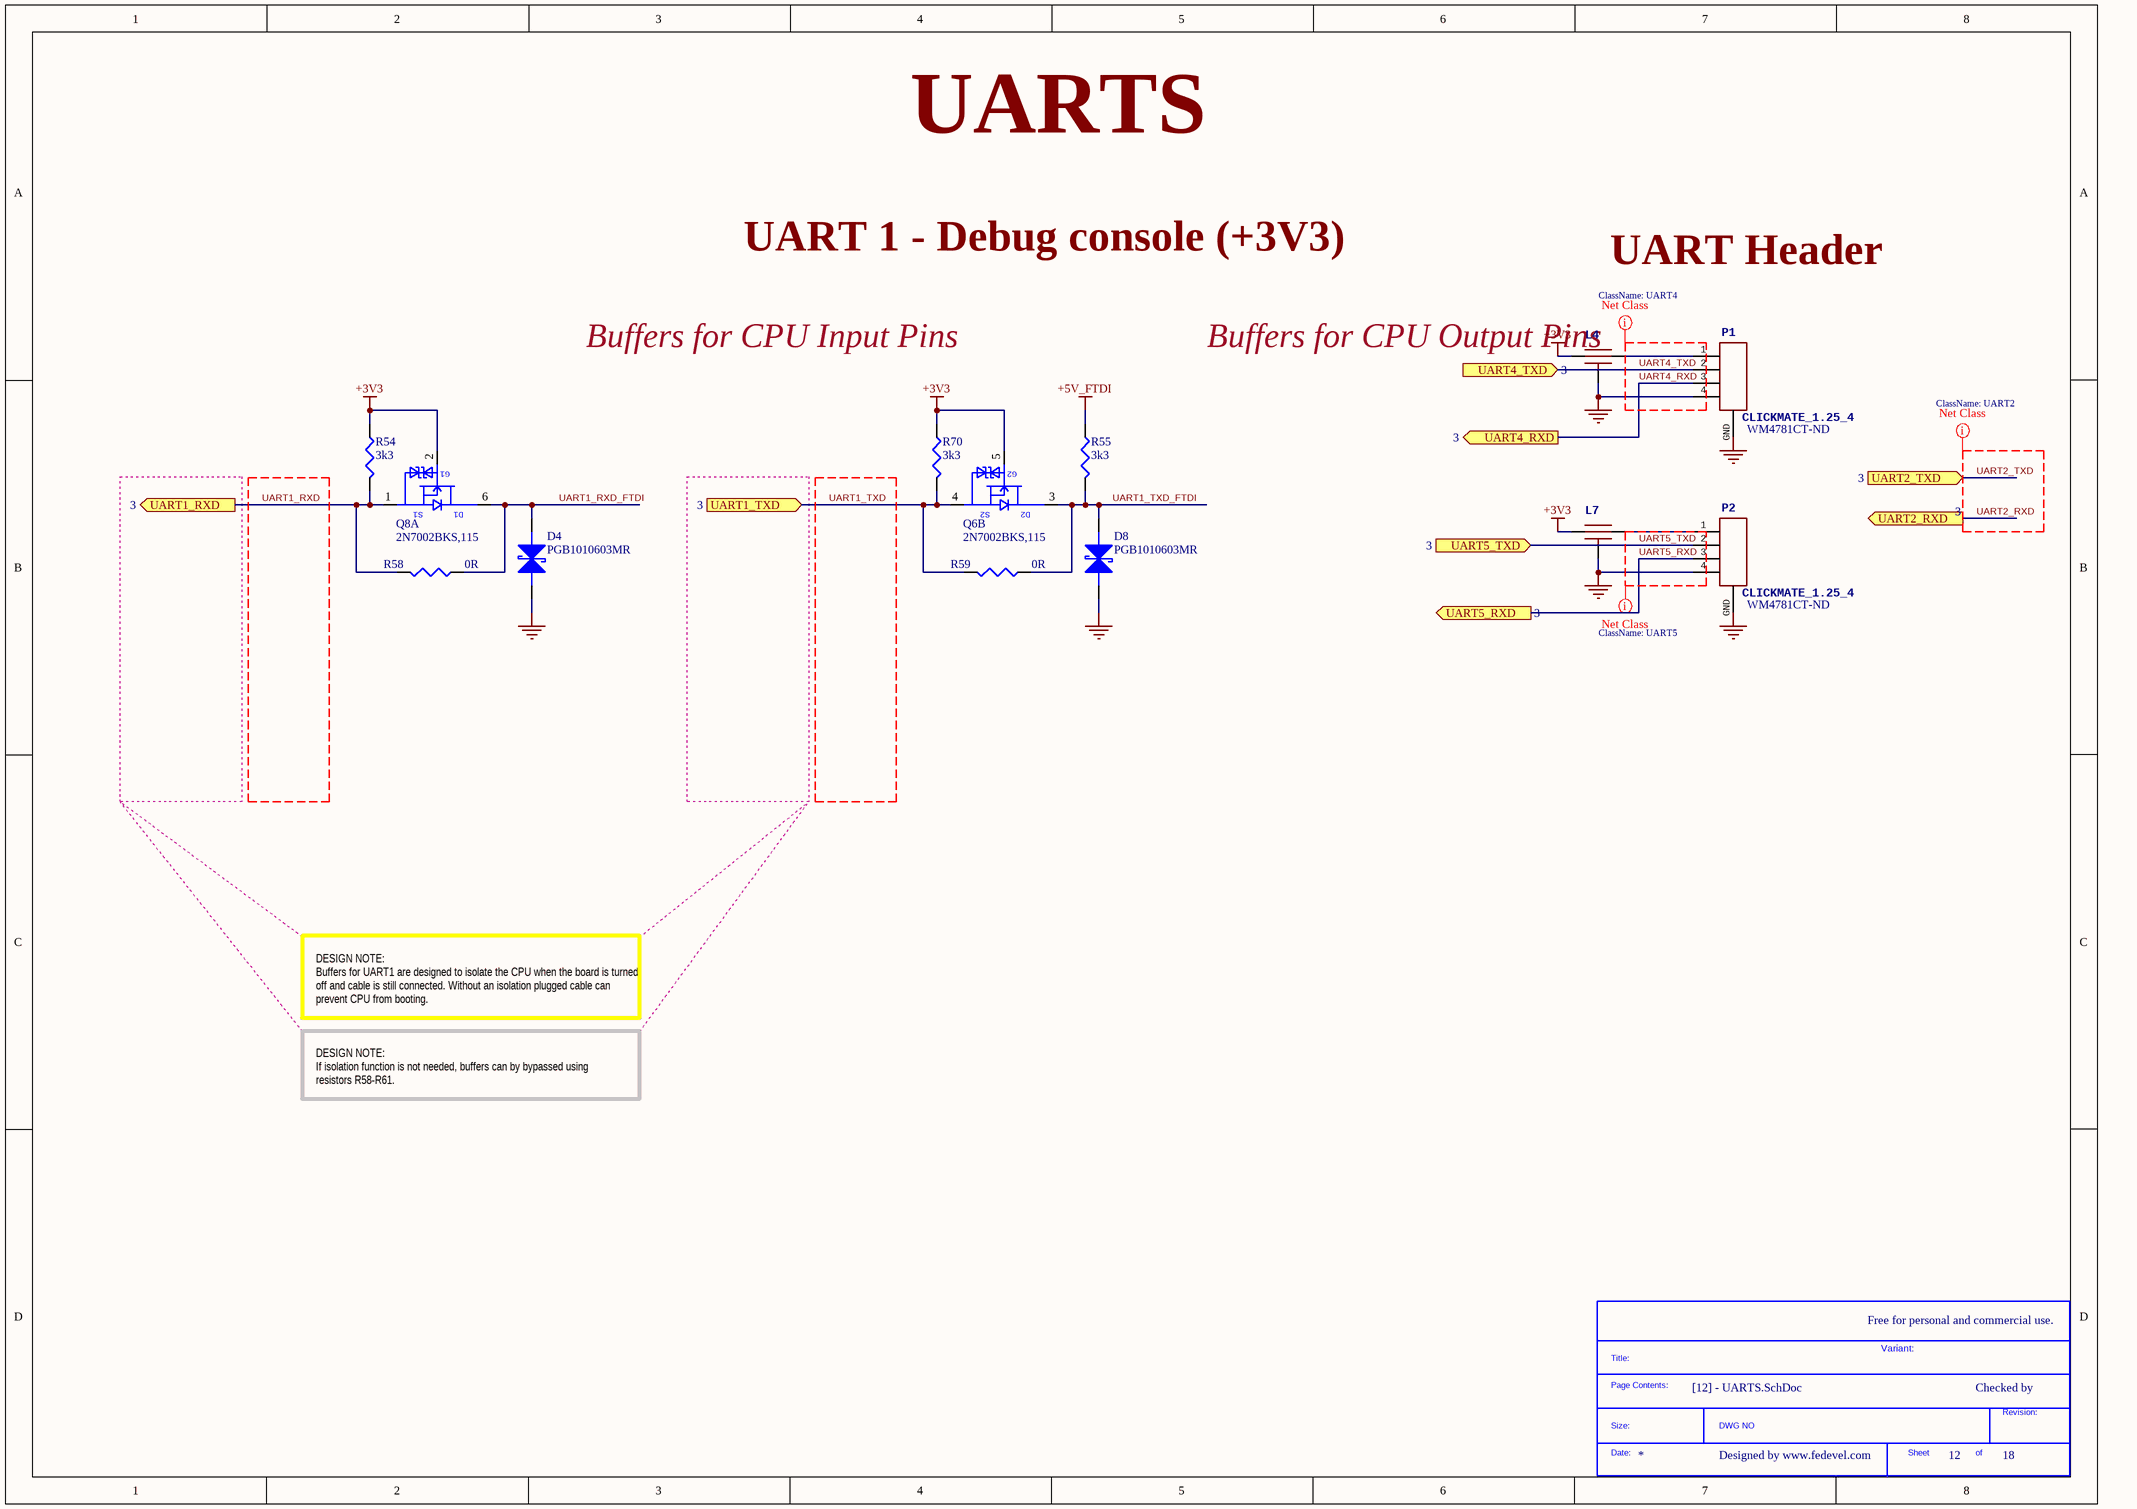
[diagram p13: [12] - UARTS.SchDoc]

### Parts
(Parts that share a designator on the sheet are numbered #1, #2 ... from top to bottom, then left to right.)
*#9  SDTitleBlock  (value not drawn)  (graphical)
D4  PGB1010603MR  [C0603]
D8  PGB1010603MR  [C0603]
L4  Kyocera KNH16C104DA5TS EMI filter  [KYOCERA-KNH16-DA]  (value not drawn)
L7  Kyocera KNH16C104DA5TS EMI filter  [KYOCERA-KNH16-DA]  (value not drawn)
P1  CLICKMATE_1.25_4  Supplier Part Number 1: WM4781CT-ND  [CLICKMATE_V4]
P2  CLICKMATE_1.25_4  Supplier Part Number 1: WM4781CT-ND  [CLICKMATE_V4]
Q6  2N7002BKS,115  [SOT363]  (part B of 2)
Q8  2N7002BKS,115  [SOT363]  (part A of 2)
R54  3k3  [R0402]
R55  3k3  [R0402]
R58  0R  [R0402]
R59  0R  [R0402]
R70  3k3  [R0402]

### Ports
UART1_RXD (out, see 3), UART1_TXD (in, see 3), UART2_RXD (out, see 3), UART2_TXD (in, see 3), UART4_RXD (out, see 3), UART4_TXD (in, see 3), UART5_RXD (out, see 3), UART5_TXD (in, see 3)

### Nets
+3V3: L4.P$1 L7.P$1 Q6.5(GATE2) Q8.2(GATE1) R54.2 R70.2
+5V_FTDI: R55.2
GND: D4.2 D8.2 L4.GND L7.GND P1.4 P1.GND P2.4 P2.GND
UART1_RXD: Q8.1(SOURCE1) R54.1 R58.1 ; port UART1_RXD
UART1_RXD_FTDI: D4.1 Q8.6(DRAIN1) R58.2
UART1_TXD: Q6.4(SOURCE2) R59.1 R70.1 ; port UART1_TXD
UART1_TXD_FTDI: D8.1 Q6.3(DRAIN2) R55.1 R59.2
UART4_RXD: P1.3 ; port UART4_RXD
UART4_TXD: P1.2 ; port UART4_TXD
UART5_RXD: P2.3 ; port UART5_RXD
UART5_TXD: P2.2 ; port UART5_TXD
NetL4_P$2: L4.P$2 P1.1
NetL7_P$2: L7.P$2 P2.1

### Layout directives
net class UART2: UART2_RXD, UART2_TXD
net class UART4: UART4_RXD, UART4_TXD
net class UART5: UART5_RXD, UART5_TXD

### Notes on the sheet
- UARTS
- UART 1 - Debug console (+3V3)
- UART Header
- Buffers for CPU Input Pins
- Buffers for CPU Output Pins
- DESIGN NOTE:
  Buffers for UART1 are designed to isolate the CPU when the board is turned off and cable is still connected. Without an isolation plugged cable can prevent CPU from booting.
- DESIGN NOTE:
  If isolation function is not needed, buffers can by bypassed using resistors R58-R61.
- Free for personal and commercial use.
- Variant:
- Checked by
- Designed by www.fedevel.com
- (in symbol 2N7002BKS,115, part A) G1; S1; D1
- (in symbol 2N7002BKS,115, part B) G2; S2; D2
- (in symbol SDTitleBlock) Title:; Page Contents:; Revision:; Size:; DWG NO; Date:; Sheet; of

### Library data of the parts
D4 D8 = PGB1010603MR: as D19 on sheet [09] - USB; Supplier 1: Digi-Key; Manufacturer Part Number: PGB1010603MR; RoHS: RoHS Compliant; Category: Circuit Protection; Stock 1: 155406; Pricing 1: 1=0.66, 10=0.556, 25=0.4872, 100=0.4172, 250=0.3618, 500=0.30646 (USD); Packaging: Cut Tape (CT); Voltage - Breakdown: -; Power (Watts): -; Mounting Type: Surface Mount; Package / Case: 0603 (1608 Metric); Supplier Device Package: 0603 (1608 Metric); ComponentLink1URL: http://www.littelfuse.com/data/en/Data_Sheets/Littelfuse_PulseGuard-ESD_PGB1.pdf; ComponentLink1Description: http://www.littelfuse.com/data/en/Data_Sheets/Littelfuse_PulseGuard-ESD_PGB1.pdf; Supplier Part Number 1: F2594CT-ND; .Checked SCH: used
L4 L7 = KNH16C104DA5TS: Capacitor, Filter, 0.1uF, 25V, 2A, 0603, SMD; 3DR_PARTNO: ECM0719; Supplier 1: Digi-Key; Supplier Part Number 1: 478-6878-1-ND
P1 P2 = CLICKMATE_1.25_4: Connector, Rcpt, 4Pos, 1.25MM, W/B, VERT, SMD, Tin; 3DR_PARTNO: PRT0441; Supplier 1: Digi-Key
Q6 Q8 = 2N7002BKS,115: MOSFET 2N-CH 60V 0.3A 6TSSOP; Manufacturer: NXP Semiconductors; FET Type: 2 N-Channel (Dual); FET Feature: Logic Level Gate; Current - Continuous Drain (Id) @ 25°C: 300mA; Rds On (Max) @ Id, Vgs: 1.6 Ohm @ 500mA, 10V; Vgs(th) (Max) @ Id: 2.1V @ 250µA; Gate Charge (Qg) @ Vgs: 0.6nC @ 4.5V; Input Capacitance (Ciss) @ Vds: 50pF @ 10V; Power - Max: 295mW; .Creator: MM; Supplier 1: Digi-Key; Manufacturer Part Number: 2N7002BKS,115; RoHS: RoHS Compliant; Category: Discrete Semiconductor Products; Stock 1: 34098; Pricing 1: 1=0.54, 10=0.389, 25=0.3028, 100=0.2293, 250=0.16212, 500=0.12978, 1000=0.09954 (USD); Packaging: Cut Tape (CT); Drain to Source Voltage (Vdss): 60V; Mounting Type: Surface Mount; Package / Case: 6-TSSOP, SC-88, SOT-363; Supplier Device Package: 6-TSSOP; ComponentLink1URL: http://www.nxp.com/documents/data_sheet/2N7002BKS.pdf; ComponentLink1Description: http://www.nxp.com/documents/data_sheet/2N7002BKS.pdf; Supplier Part Number 1: 568-5977-1-ND; .Checked SCH: MM; .Checked PCB: MM; Referenced footrpint used by MM: http://www.diodes.com/_files/datasheets/ap02001.pdf
R54 R55 R70 = RC0402FR-073K3L: RES 3.30K OHM 1/16W 1% 0402 SMD; Manufacturer: Yageo; Resistance (Ohms): 3.3K; Power (Watts): 0.063W, 1/16W; .Checked PCB: used; Temperature Coefficient: ±100ppm/°C; Category: Resistors; Supplier Part Number: 311-3.30KLRCT-ND; Manufacturer Part Number: RC0402FR-073K3L; Package / Case: 0402 (1005 Metric); Price 1k [$]: 0.01421; Tolerance: ±1%; Value: 3k3; .Checked SCH: used; Supplier: Digikey; Supplier 1: Digi-Key; Supplier Part Number 1: 311-3.30KLRCT-ND; RoHS: RoHS Compliant; Stock 1: 356340; Pricing 1: 10=0.014, 50=0.0104, 100=0.0079, 250=0.00584, 500=0.00432, 1000=0.00288 (USD); Composition: Thick Film; Features: -; Size / Dimension: 0.039" L x 0.020" W (1.00mm x 0.50mm); Height: 0.016" (0.40mm); Number of Terminations: 2; Packaging: Cut Tape (CT); ComponentLink1URL: http://www.yageo.com/documents/recent/PYu-RC0402_51_RoHS_L_6.pdf; ComponentLink1Description: http://www.yageo.com/documents/recent/PYu-RC0402_51_RoHS_L_6.pdf
R58 R59 = RC0402JR-070RL: as R63 on sheet [09] - USB; Category: Resistors; Supplier Part Number: 311-0.0JRCT-ND; Manufacturer Part Number: RC0402JR-070RL; Package / Case: 0402 (1005 Metric); Price 1k [$]: 0.01389; Value: 0R; .Checked SCH: used; Supplier: Digikey; Supplier 1: Digi-Key; Supplier Part Number 1: 311-0.0JRCT-ND; RoHS: RoHS Compliant; Stock 1: 1106330; Pricing 1: 10=0.012, 50=0.009, 100=0.0069, 250=0.00512, 500=0.0038, 1000=0.00253 (USD); Composition: Thick Film; Features: -; Temperature Coefficient: -; Size / Dimension: 0.039" L x 0.020" W (1.00mm x 0.50mm); Height: 0.016" (0.40mm); Number of Terminations: 2; Packaging: Cut Tape (CT); ComponentLink1URL: http://www.yageo.com/documents/recent/PYu-RC0402_51_RoHS_L_6.pdf; ComponentLink1Description: http://www.yageo.com/documents/recent/PYu-RC0402_51_RoHS_L_6.pdf

## Sheet [13] - HEADERS, SPI.SchDoc
size A2; DocumentNumber: 13; SheetNumber: 13; SheetTotal: 18
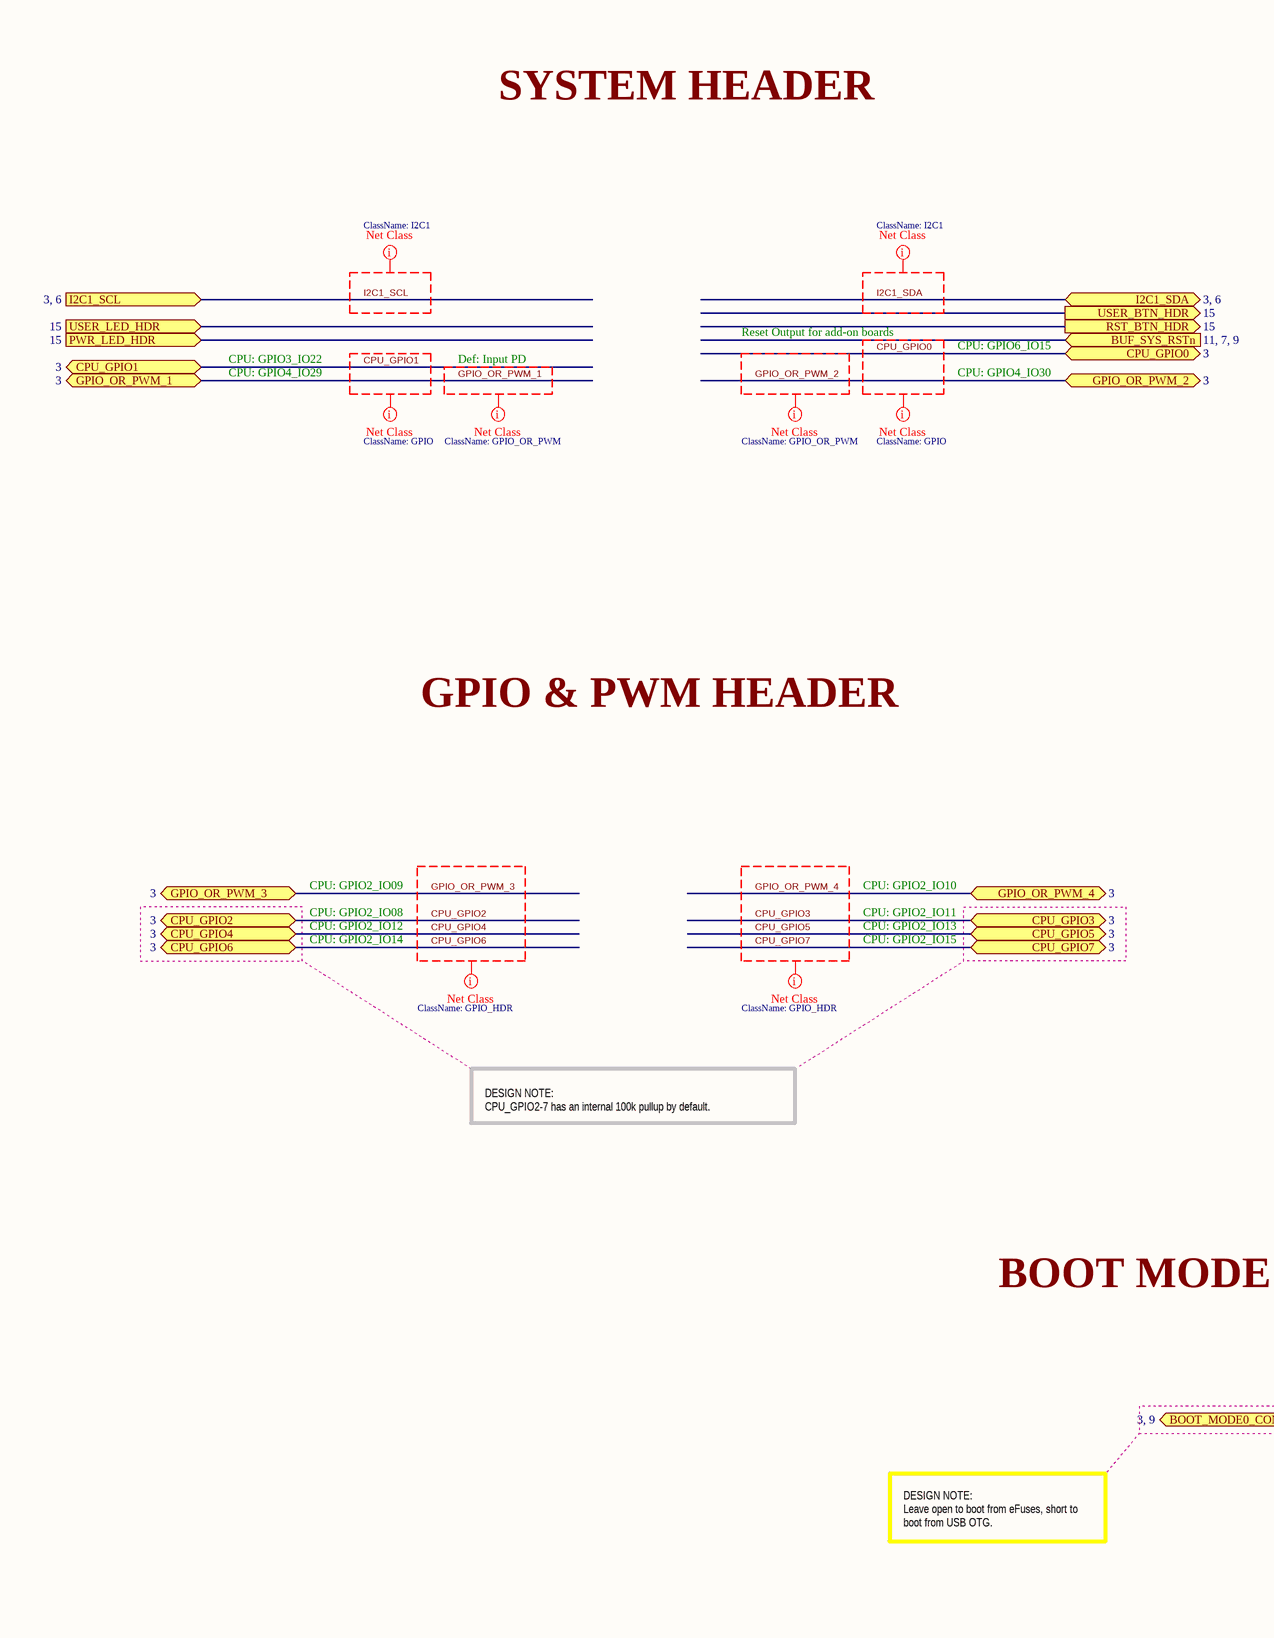
[diagram p14: [13] - HEADERS, SPI.SchDoc, left]
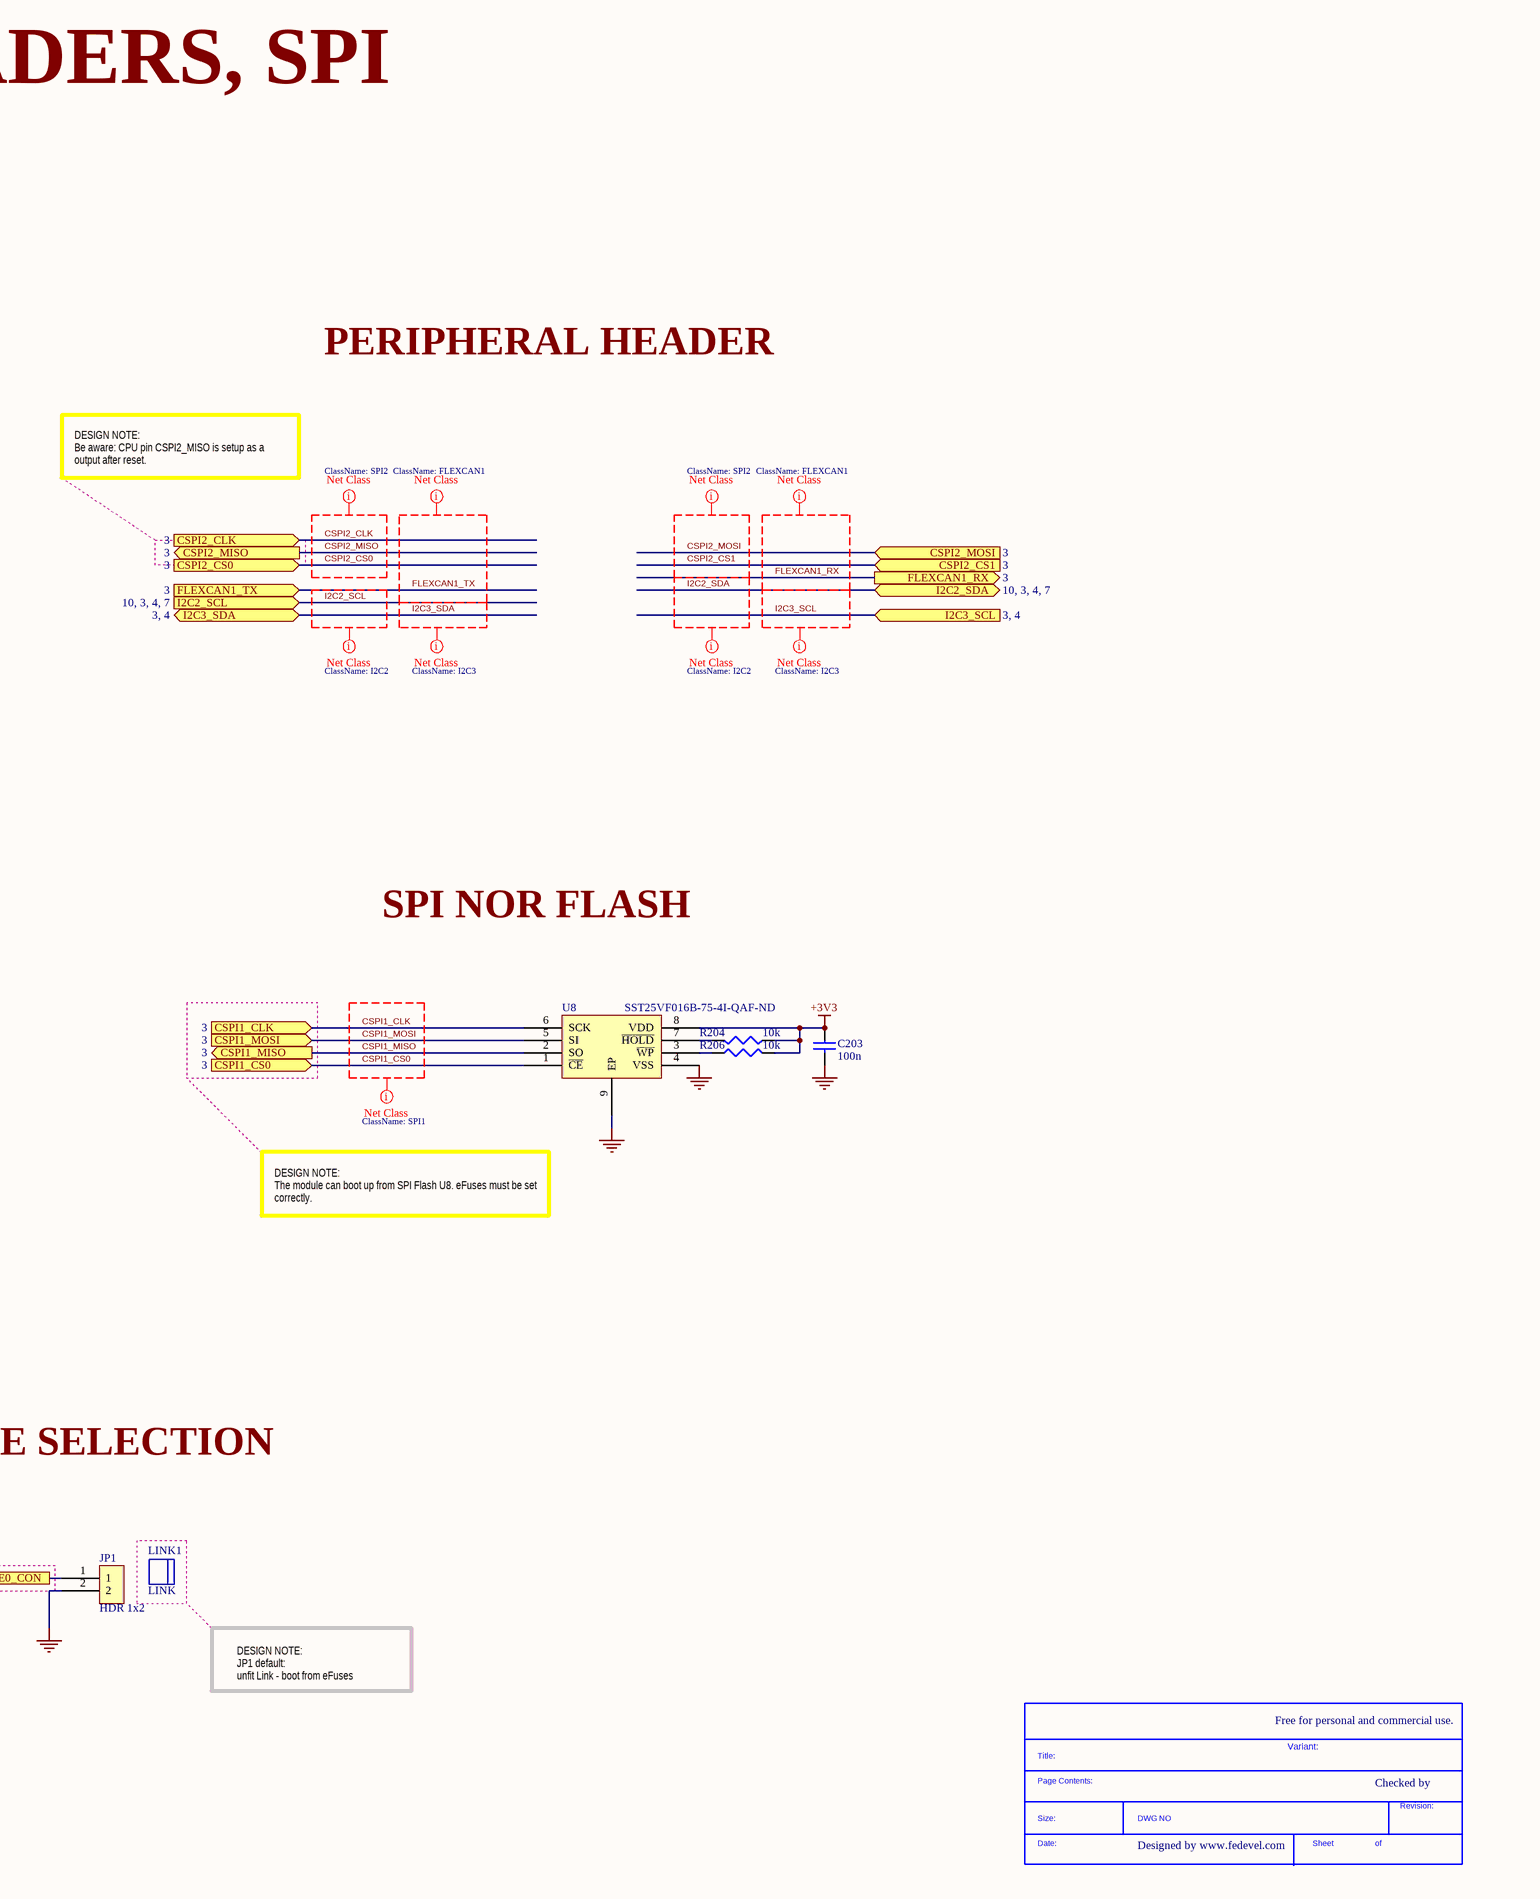
[diagram p15: [13] - HEADERS, SPI.SchDoc, right]

### Parts
(Parts that share a designator on the sheet are numbered #1, #2 ... from top to bottom, then left to right.)
*#10  SDTitleBlock  (value not drawn)  (graphical)
C203  100n  [C0402]
JP1  HDR 1x2  [HDR_1x2_2.54MM]
LINK1  LINK  (mechanical)
R204  10k  [R0402]
R206  10k  [R0402]
U8  SST25VF016B-75-4I-QAF-ND  [WSON8_6X5MM]

### Ports
BOOT_MODE0_CON (see 3, 9), BUF_SYS_RSTn (see 11, 7, 9), CPU_GPIO0 (bidir, see 3), CPU_GPIO1 (bidir, see 3), CPU_GPIO2 (bidir, see 3), CPU_GPIO3 (bidir, see 3), CPU_GPIO4 (bidir, see 3), CPU_GPIO5 (bidir, see 3), CPU_GPIO6 (bidir, see 3), CPU_GPIO7 (bidir, see 3), CSPI1_CLK (in, see 3), CSPI1_CS0 (in, see 3), CSPI1_MISO (out, see 3), CSPI1_MOSI (in, see 3), CSPI2_CLK (in, see 3), CSPI2_CS0 (in, see 3), CSPI2_CS1 (in, see 3), CSPI2_MISO (out, see 3), CSPI2_MOSI (in, see 3), FLEXCAN1_RX (out, see 3), FLEXCAN1_TX (in, see 3), GPIO_OR_PWM_1 (bidir, see 3), GPIO_OR_PWM_2 (bidir, see 3), GPIO_OR_PWM_3 (bidir, see 3), GPIO_OR_PWM_4 (bidir, see 3), I2C1_SCL (see 3, 6), I2C1_SDA (bidir, see 3, 6), I2C2_SCL (see 10, 3, 4, 7), I2C2_SDA (bidir, see 10, 3, 4, 7), I2C3_SCL (see 3, 4), I2C3_SDA (bidir, see 3, 4), PWR_LED_HDR (in, see 15), RST_BTN_HDR (out, see 15), USER_BTN_HDR (out, see 15), USER_LED_HDR (in, see 15)

### Nets
+3V3: C203.1 R204.1 R206.2 U8.8(VDD)
GND: C203.2 JP1.2 U8.4(VSS) U8.9(EP)
CSPI1_CLK: U8.6(SCK) ; port CSPI1_CLK
CSPI1_CS0: U8.1(~{CE}) ; port CSPI1_CS0
CSPI1_MISO: U8.2(SO) ; port CSPI1_MISO
CSPI1_MOSI: U8.5(SI) ; port CSPI1_MOSI
NetJ2_3: JP1.1 ; port BOOT_MODE0_CON
NetR204_2: R204.2 U8.7(~{HOLD})
NetR206_1: R206.1 U8.3(~{WP})

### Layout directives
net class SPI1: CSPI1_CLK, CSPI1_CS0, CSPI1_MISO, CSPI1_MOSI
net class GPIO: CPU_GPIO0, CPU_GPIO1
net class GPIO_OR_PWM: GPIO_OR_PWM_1, GPIO_OR_PWM_2
net class I2C3: I2C3_SCL, I2C3_SDA
net class I2C2: I2C2_SCL, I2C2_SDA
net class SPI2: CSPI2_CLK, CSPI2_CS0, CSPI2_CS1, CSPI2_MISO, CSPI2_MOSI
net class GPIO_HDR: CPU_GPIO2, CPU_GPIO3, CPU_GPIO4, CPU_GPIO5, CPU_GPIO6, CPU_GPIO7, GPIO_OR_PWM_3, GPIO_OR_PWM_4
net class I2C1: I2C1_SCL, I2C1_SDA
net class FLEXCAN1: FLEXCAN1_RX, FLEXCAN1_TX

### Notes on the sheet
- HEADERS, SPI
- SYSTEM HEADER
- PERIPHERAL HEADER
- DESIGN NOTE:
  Be aware: CPU pin CSPI2_MISO is setup as a output after reset.
- CPU: GPIO4_IO29
- CPU: GPIO3_IO22
- Def: Input PD
- Reset Output for add-on boards
- CPU: GPIO6_IO15
- CPU: GPIO4_IO30
- GPIO & PWM HEADER
- SPI NOR FLASH
- CPU: GPIO2_IO09
- CPU: GPIO2_IO08
- CPU: GPIO2_IO10
- CPU: GPIO2_IO11
- CPU: GPIO2_IO12
- CPU: GPIO2_IO14
- CPU: GPIO2_IO13
- CPU: GPIO2_IO15
- DESIGN NOTE:
  The module can boot up from SPI Flash U8. eFuses must be set correctly.
- DESIGN NOTE:
  CPU_GPIO2-7 has an internal 100k pullup by default.
- BOOT MODE SELECTION
- DESIGN NOTE:
  Leave open to boot from eFuses, short to boot from USB OTG.
- DESIGN NOTE:
  JP1 default:
  unfit Link - boot from eFuses
- Free for personal and commercial use.
- Variant:
- Checked by
- Designed by www.fedevel.com
- (in symbol SDTitleBlock) Title:; Page Contents:; Revision:; Size:; DWG NO; Date:; Sheet; of

### Library data of the parts
C203 = C1005X5R1H104K: as C26 on sheet [09] - USB; Category: Capacitors; Manufacturer Part Number: C1005X5R1H104K; Operating Temperature: -55°C ~ 85°C; Package / Case: 0402 (1005 Metric); Price 1k [$]: 0.02340; .Checked SCH: used; Voltage - Rated: 50V; Supplier Part Number: 445-5942-1-ND; Supplier: Digikey; Supplier 1: Digi-Key; Supplier Part Number 1: 445-5942-1-ND; RoHS: RoHS Compliant; Stock 1: 106926; Pricing 1: 1=0.27, 10=0.18, 100=0.072, 250=0.05176, 500=0.0369, 1000=0.027 (USD); Tolerance: ±10%; Temperature Coefficient: X5R; Mounting Type: Surface Mount, MLCC; Applications: General Purpose; Ratings: -; Size / Dimension: 0.039" L x 0.020" W (1.00mm x 0.50mm); Height - Seated (Max): -; Thickness (Max): 0.022" (0.55mm); Lead Spacing: -; Features: -; Packaging: Cut Tape (CT); Lead Style: -; ComponentLink1URL: http://www.tdk.co.jp/tefe02/e412_c.pdf; ComponentLink1Description: http://www.tdk.co.jp/tefe02/e412_c.pdf
JP1 = 68001-202HLF: BERGSTIK II .100" SR STRAIGHT; Manufacturer: FCI; Connector Type: Header, Unshrouded; Number of Positions: 2; Number of Positions Loaded: All; Pitch: 0.100" (2.54mm); .Checked PCB: used; Supplier 1: Digi-Key; Supplier Part Number 1: 609-3469-ND; Manufacturer Part Number: 68001-202HLF; RoHS: RoHS Compliant; Category: Connectors, Interconnects; Stock 1: 13680; Pricing 1: 1=0.45, 10=0.265, 100=0.1172, 250=0.09828, 500=0.09072, 1000=0.07938, 5000=0.05065 (USD); Contact Type: Male Pin; Number of Rows: 1; Row Spacing: -; Contact Mating Length: 0.230" (5.84mm); Mounting Type: Through Hole; Termination: Solder; Fastening Type: -; Features: -; Contact Finish: Gold; Contact Finish Thickness: 15µin (0.38µm); Color: Black; Packaging: Bulk; ComponentLink1URL: http://portal.fciconnect.com/res/en/pdffiles/doc_search/68000.pdf; ComponentLink1Description: http://portal.fciconnect.com/res/en/pdffiles/doc_search/68000.pdf; .Checked SCH: used
LINK1 = QPC02SXGN-RC: CONN JUMPER SHORTING .100" GOLD; Manufacturer: Sullins Connector Solutions; Gender: Female Sockets; Number of Positions or Pins (Grid): 2 (1 x 2); Pitch: 0.100" (2.54mm); .Checked SCH: used; Supplier 1: Digi-Key; Supplier Part Number 1: S9337-ND; Manufacturer Part Number: QPC02SXGN-RC; RoHS: RoHS Compliant; Category: Connectors, Interconnects; Stock 1: 23274; Pricing 1: 1=0.11, 10=0.066, 25=0.0468, 50=0.0384, 100=0.033, 250=0.02792, 500=0.0258, 1000=0.0228, 2500=0.018 (USD); Type: Open Top; Height: 0.235" (5.97mm); Contact Finish: Gold; Contact Finish Thickness: Flash; Color: -; Packaging: Bulk; ComponentLink1URL: http://www.sullinscorp.com/drawings/284_SXGN_11510.pdf; ComponentLink1Description: http://www.sullinscorp.com/drawings/284_SXGN_11510.pdf
R204 R206 = RC0402FR-0710KL: as R45 on sheet [09] - USB; Category: Resistors; Manufacturer Part Number: RC0402FR-0710KL; Package / Case: 0402 (1005 Metric); Price 1k [$]: 0.01421; Resistance (Ohms): 10K; Tolerance: ±1%; Value: 10k; .Checked SCH: used; Supplier Part Number: 311-10.0KLRCT-ND; Supplier: Digikey; Supplier 1: Digi-Key; Supplier Part Number 1: 311-10.0KLRCT-ND; RoHS: RoHS Compliant; Stock 1: 2916495; Pricing 1: 10=0.014, 50=0.0104, 100=0.0079, 250=0.00584, 500=0.00432, 1000=0.00288 (USD); Composition: Thick Film; Features: -; Size / Dimension: 0.039" L x 0.020" W (1.00mm x 0.50mm); Height: 0.016" (0.40mm); Number of Terminations: 2; Packaging: Cut Tape (CT); ComponentLink1URL: http://www.yageo.com/documents/recent/PYu-RC0402_51_RoHS_L_6.pdf; ComponentLink1Description: http://www.yageo.com/documents/recent/PYu-RC0402_51_RoHS_L_6.pdf
U8 = SST25VF016B-75-4I-QAF: IC FLASH 16MBIT 75MHZ 8WSON; Manufacturer: Microchip Technology; Memory Size: 16M (2M x 8); Interface: SPI Serial; Voltage - Supply: 2.7 V ~ 3.6 V; .Creator: MM; .Checked PCB: used; Supplier 1: Digi-Key; Manufacturer Part Number: SST25VF016B-75-4I-QAF; RoHS: RoHS Compliant; Category: Integrated Circuits (ICs); Stock 1: 433; Pricing 1: 1=1.58, 10=1.512, 25=1.4492, 100=1.16, 500=0.97, 1000=0.925 (USD); Packaging: Tube; Format - Memory: FLASH; Memory Type: FLASH; Speed: 75MHz; Operating Temperature: -40°C ~ 85°C; Package / Case: 8-WSON; Supplier Device Package: 8-WSON; ComponentLink1URL: http://ww1.microchip.com/downloads/en/DeviceDoc/25044A.pdf; ComponentLink1Description: http://ww1.microchip.com/downloads/en/DeviceDoc/25044A.pdf; Supplier Part Number 1: SST25VF016B-75-4I-QAF-ND; .Checked SCH: used